# EAGLE design transponder-7.0.0 (EAGLE 9.6.1)
Assembly variants: Supercap, No supercap

## Sheet 1 of 7
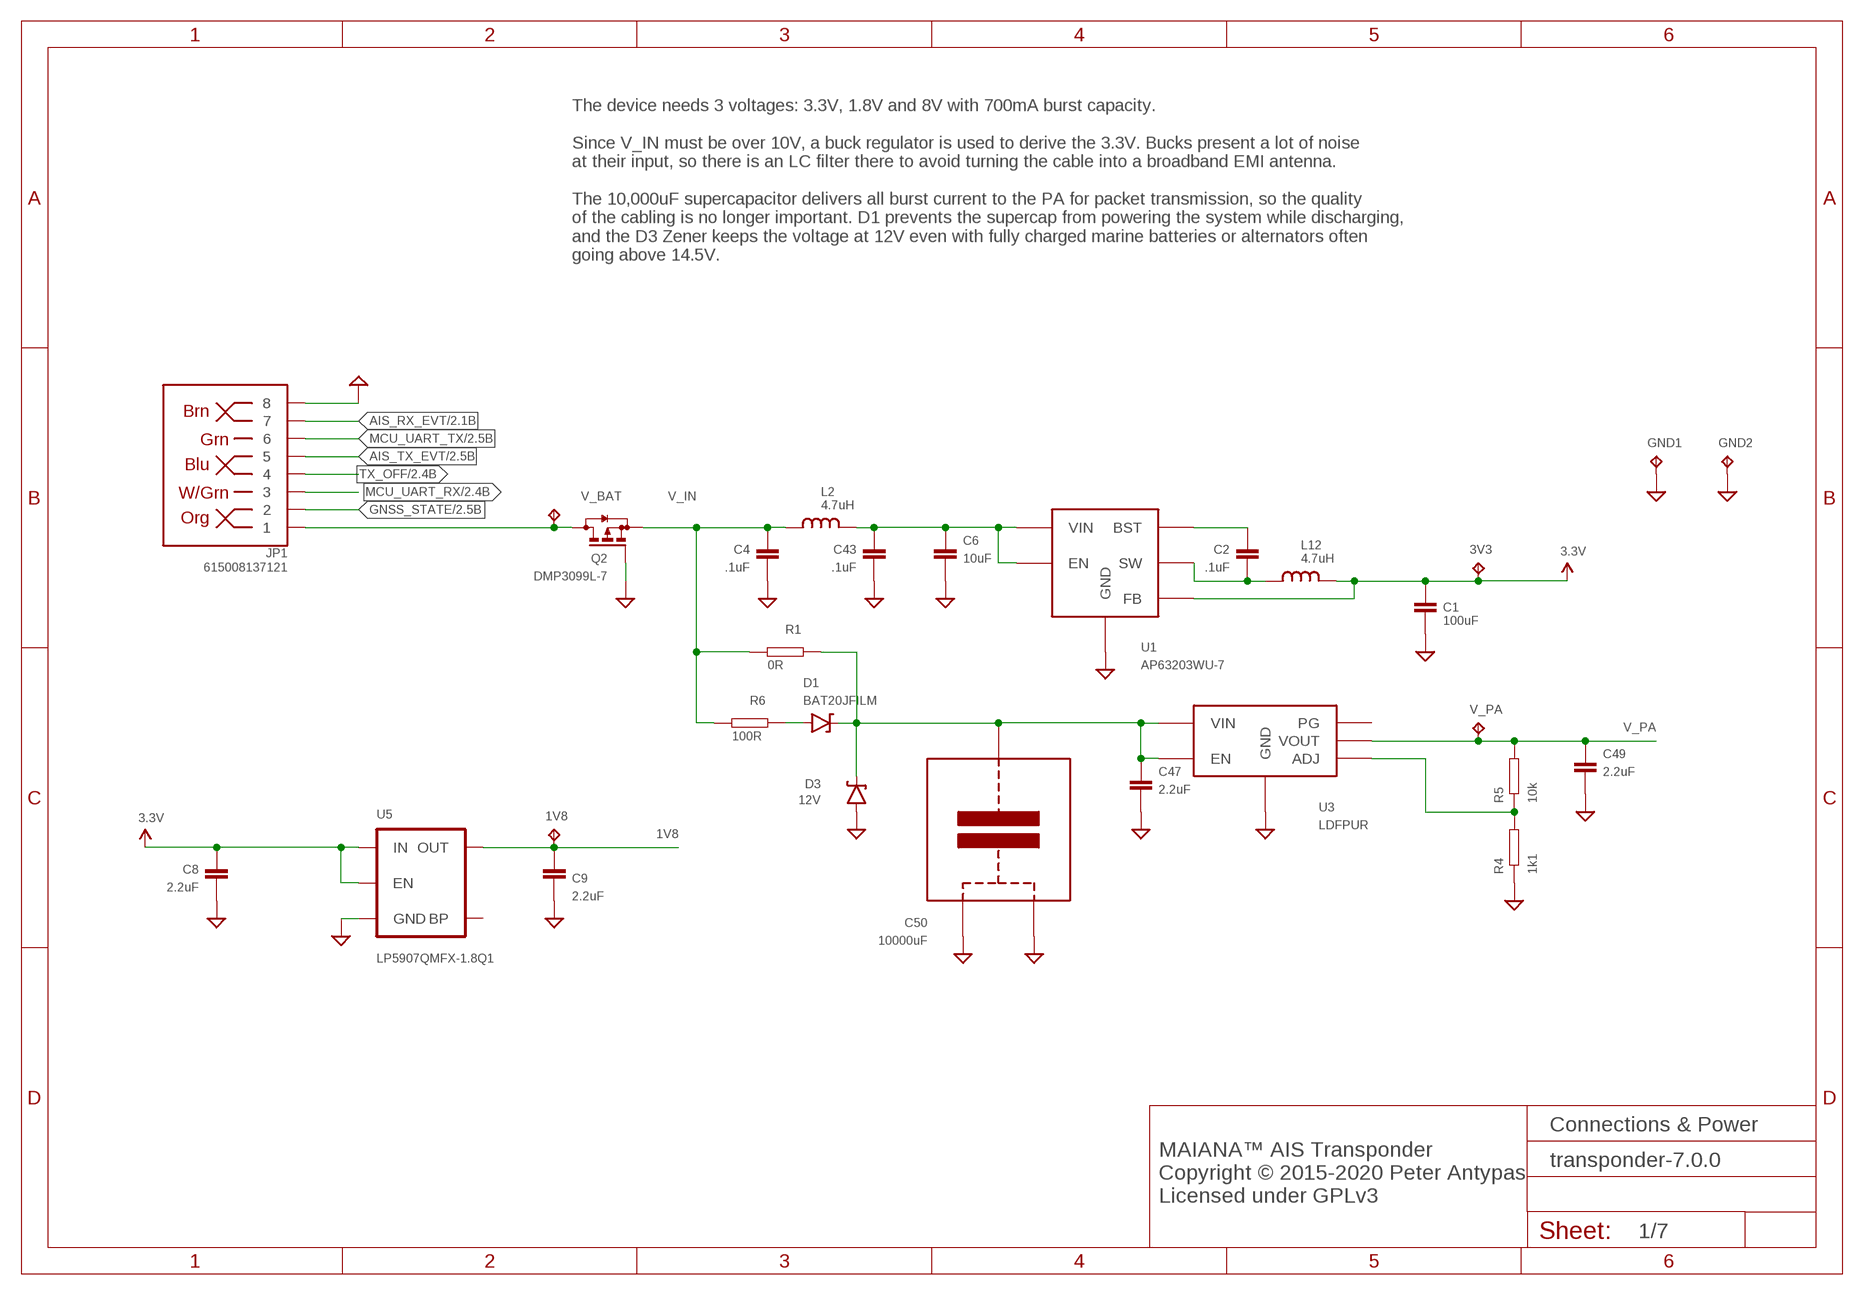
[diagram p0: schematic, sheet 1]

### Parts
1V8  TPTP12R  [TP12R]
3V3  TPTP12R  [TP12R]
C1  100uF  CAPACITOR1206  [1206]
C2  .1uF  CAPACITOR0603  [0603]
C4  .1uF  CAPACITOR0603  [0603]
C6  10uF  CAPACITOR0805  [0805]
C8  2.2uF  CAPACITOR0603  [0603]
C9  2.2uF  CAPACITOR0603  [0603]
C43  .1uF  CAPACITOR0603  [0603]
C47  2.2uF  CAPACITOR0603  [0603]
C49  2.2uF  CAPACITOR0603  [0603]
C50  10000uF  BZ05CA103ZSB  [BZ05]  (not fitted in variant No supercap)
D1  BAT20JFILM  DIODE-SCHOTTKYSOD323  [SOD323]  (not fitted in variant No supercap)
D3  12V  DIODE-ZENER5.6V  [SOD-323]  (not fitted in variant No supercap)
GND1  TPTP16R  [TP16R]
GND2  TPTP16R  [TP16R]
JP1  615008137121  RJ45-8PTH  [RJ45-8]
L2  4.7uH  INDUCTOR0805  [0805]
L12  4.7uH  INDUCTOR0805  [0805]
Q2  DMP3099L-7  BSS84  [SOT23]
R1  0R  RESISTOR0603  [0603]  (not fitted in variant Supercap)
R4  1k1  RESISTOR0603  [0603]
R5  10k  RESISTOR0603  [0603]
R6  100R  RESISTOR0603  [0603]  (not fitted in variant No supercap)
U1  AP63203WU-7  AP63203  [SOT23-6]
U3  LDFPUR  LDF  [DFN-6]
U5  LP5907QMFX-1.8Q1  V_REG_LDOSMD  [SOT23-5]
V_BAT  TPTP12R  [TP12R]
V_PA  TPTP12R  [TP12R]

### Nets
1V8: 1V8.TP C9.P$1 U5.5(OUT) ; also sheet 6,7
3.3V: 3V3.TP C1.P$1 C8.P$1 L12.P$2 U1.1(FB) U5.1(IN) U5.3(EN) ; also sheet 2,3,4,6,7
AIS_RX_EVT: JP1.7 ; also sheet 2
AIS_TX_EVT: JP1.5 ; also sheet 2
BST: C2.P$1 U1.6(BST)
GND: C1.P$2 C4.P$2 C6.P$2 C8.P$2 C9.P$2 C43.P$2 C47.P$2 C49.P$2 C50.P$1 C50.P$2 D3.A GND1.TP GND2.TP JP1.8 Q2.1(G) R4.P$1 U1.4(GND) U3.P$4(GND) U3.P$7(GND) U5.2(GND) ; also sheet 2,3,4,5,6,7
GNSS_STATE: JP1.2 ; also sheet 2
MCU_UART_RX: JP1.3 ; also sheet 2
MCU_UART_TX: JP1.6 ; also sheet 2
N$2: D1.A R6.P$2
N$27: C6.P$1 C43.P$1 L2.P$2 U1.2(EN) U1.3(VIN)
N$32: R4.P$2 R5.P$1 U3.P$2(ADJ)
SW: C2.P$2 L12.P$1 U1.5(SW)
TX_OFF: JP1.4 ; also sheet 2
V_BAT: JP1.1 Q2.3(D) V_BAT.TP
V_IN: C4.P$1 L2.P$1 Q2.2(S) R1.P$1 R6.P$1
V_PA: C49.P$1 R5.P$2 U3.P$1(VOUT) V_PA.TP ; also sheet 5
V_PA_SRC: C47.P$1 C50.P$3 D1.C D3.C R1.P$2 U3.P$5(EN) U3.P$6(VIN)
Unconnected: U3.P$3(PG) U5.4(BP)

### Notes on the sheet
- The device needs 3 voltages: 3.3V, 1.8V and 8V with 700mA burst capacity. 
  
  Since V_IN must be over 10V, a buck regulator is used to derive the 3.3V. Bucks present a lot of noise
  at their input, so there is an LC filter there to avoid turning the cable into a broadband EMI antenna.
  
  The 10,000uF supercapacitor delivers all burst current to the PA for packet transmission, so the quality
  of the cabling is no longer important. D1 prevents the supercap from powering the system while discharging,
  and the D3 Zener keeps the voltage at 12V even with fully charged marine batteries or alternators often 
  going above 14.5V.
- Connections & Power
- MAIANA™ AIS Transponder
  Copyright © 2015-2020 Peter Antypas
  Licensed under GPLv3

## Sheet 2 of 7
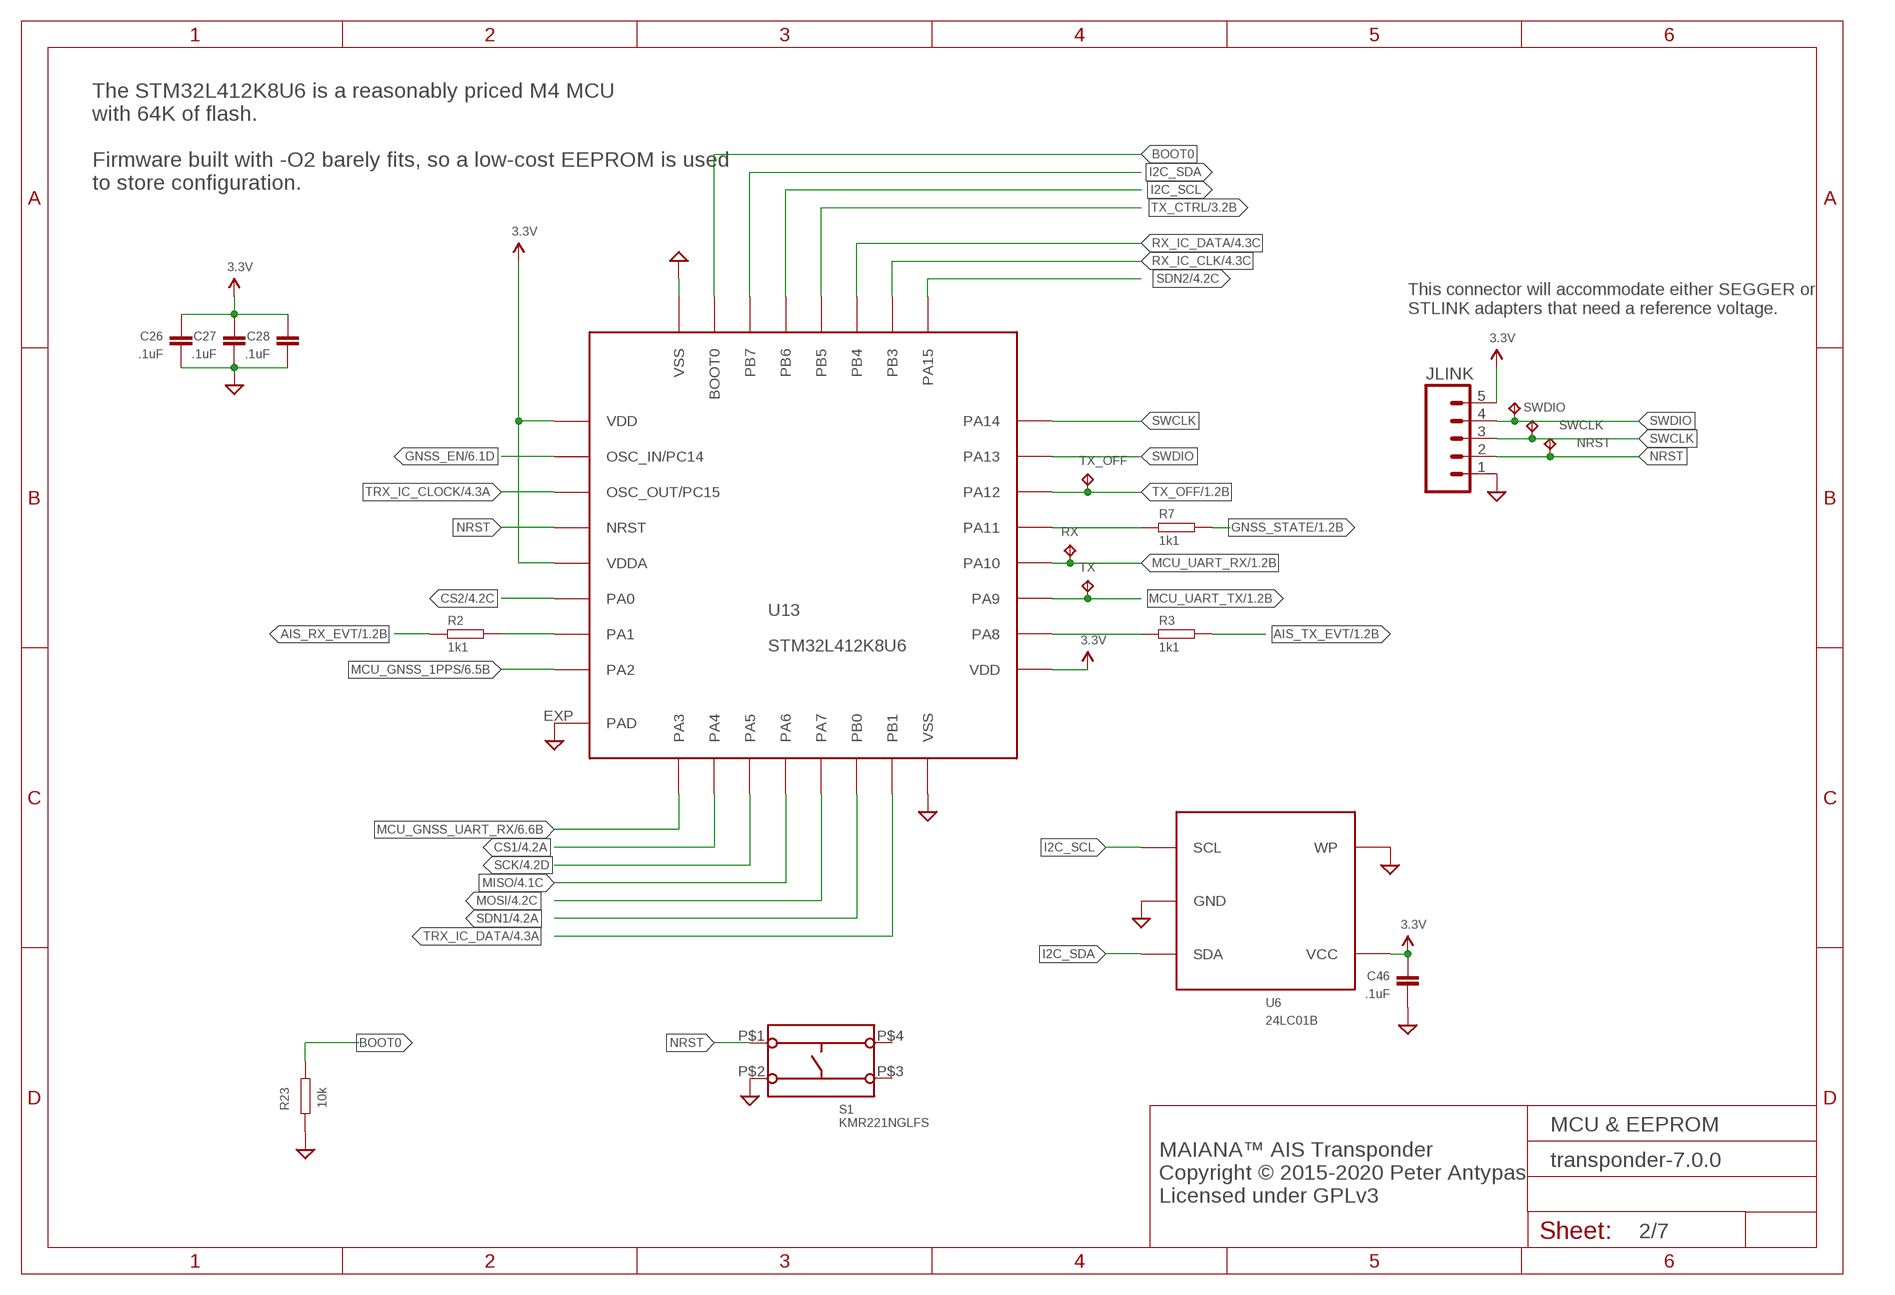
[diagram p1: schematic, sheet 2]

### Parts
C26  .1uF  CAPACITOR0603  [0603]
C27  .1uF  CAPACITOR0603  [0603]
C28  .1uF  CAPACITOR0603  [0603]
C46  .1uF  CAPACITOR0603  [0603]
JLINK  M05PTH  [1X05]
NRST  TPTP12R  [TP12R]
R2  1k1  RESISTOR0603  [0603]
R3  1k1  RESISTOR0603  [0603]
R7  1k1  RESISTOR0603  [0603]
R23  10k  RESISTOR0603  [0603]
RX  TPTP12R  [TP12R]
S1  KMR221NGLFS  [KMR221NGLFS]
SWCLK  TPTP12R  [TP12R]
SWDIO  TPTP12R  [TP12R]
TX  TPTP12R  [TP12R]
TX_OFF  TPTP12R  [TP12R]
U6  24LC01B  [SOT23-5]
U13  STM32L412K8U6  STM32L432KXXX  [QFN32]

### Nets
3.3V: C26.P$1 C27.P$1 C28.P$1 C46.P$1 JLINK.5 U6.4(VCC) U13.1(VDD) U13.5(VDDA) U13.17(VDD) ; also sheet 1,3,4,6,7
AIS_RX_EVT: R2.P$1 ; also sheet 1
AIS_TX_EVT: R3.P$2 ; also sheet 1
BOOT0: R23.P$1 U13.31(BOOT0)
CS1: U13.10(PA4) ; also sheet 4
CS2: U13.6(PA0) ; also sheet 4
GND: C26.P$2 C27.P$2 C28.P$2 C46.P$2 JLINK.1 R23.P$2 S1.P$2(S2) U6.2(GND) U6.5(WP) U13.16(VSS) U13.32(VSS) U13.EXP(PAD) ; also sheet 1,3,4,5,6,7
GNSS_EN: U13.2(OSC_IN/PC14) ; also sheet 6
GNSS_STATE: R7.P$2 ; also sheet 1
I2C_SCL: U6.1(SCL) U13.29(PB6)
I2C_SDA: U6.3(SDA) U13.30(PB7)
MCU_GNSS_1PPS: U13.8(PA2) ; also sheet 6
MCU_GNSS_UART_RX: U13.9(PA3) ; also sheet 6
MCU_UART_RX: RX.TP U13.20(PA10) ; also sheet 1
MCU_UART_TX: TX.TP U13.19(PA9) ; also sheet 1
MISO: U13.12(PA6) ; also sheet 4
MOSI: U13.13(PA7) ; also sheet 4
N$35: R2.P$2 U13.7(PA1)
N$36: R3.P$1 U13.18(PA8)
N$37: R7.P$1 U13.21(PA11)
NRST: JLINK.2 NRST.TP S1.P$1(S1) U13.4(NRST)
RX_IC_CLK: U13.26(PB3) ; also sheet 4
RX_IC_DATA: U13.27(PB4) ; also sheet 4
SCK: U13.11(PA5) ; also sheet 4
SDN1: U13.14(PB0) ; also sheet 4
SDN2: U13.25(PA15) ; also sheet 4
SWCLK: JLINK.3 SWCLK.TP U13.24(PA14)
SWDIO: JLINK.4 SWDIO.TP U13.23(PA13)
TRX_IC_CLOCK: U13.3(OSC_OUT/PC15) ; also sheet 4
TRX_IC_DATA: U13.15(PB1) ; also sheet 4
TX_CTRL: U13.28(PB5) ; also sheet 3,5,7
TX_OFF: TX_OFF.TP U13.22(PA12) ; also sheet 1
Unconnected: S1.P$3(S2) S1.P$4(S1)

### Notes on the sheet
- The STM32L412K8U6 is a reasonably priced M4 MCU
  with 64K of flash. 
  
  Firmware built with -O2 barely fits, so a low-cost EEPROM is used
  to store configuration.
- This connector will accommodate either SEGGER or
  STLINK adapters that need a reference voltage.
- MCU & EEPROM
- MAIANA™ AIS Transponder
  Copyright © 2015-2020 Peter Antypas
  Licensed under GPLv3

## Sheet 3 of 7
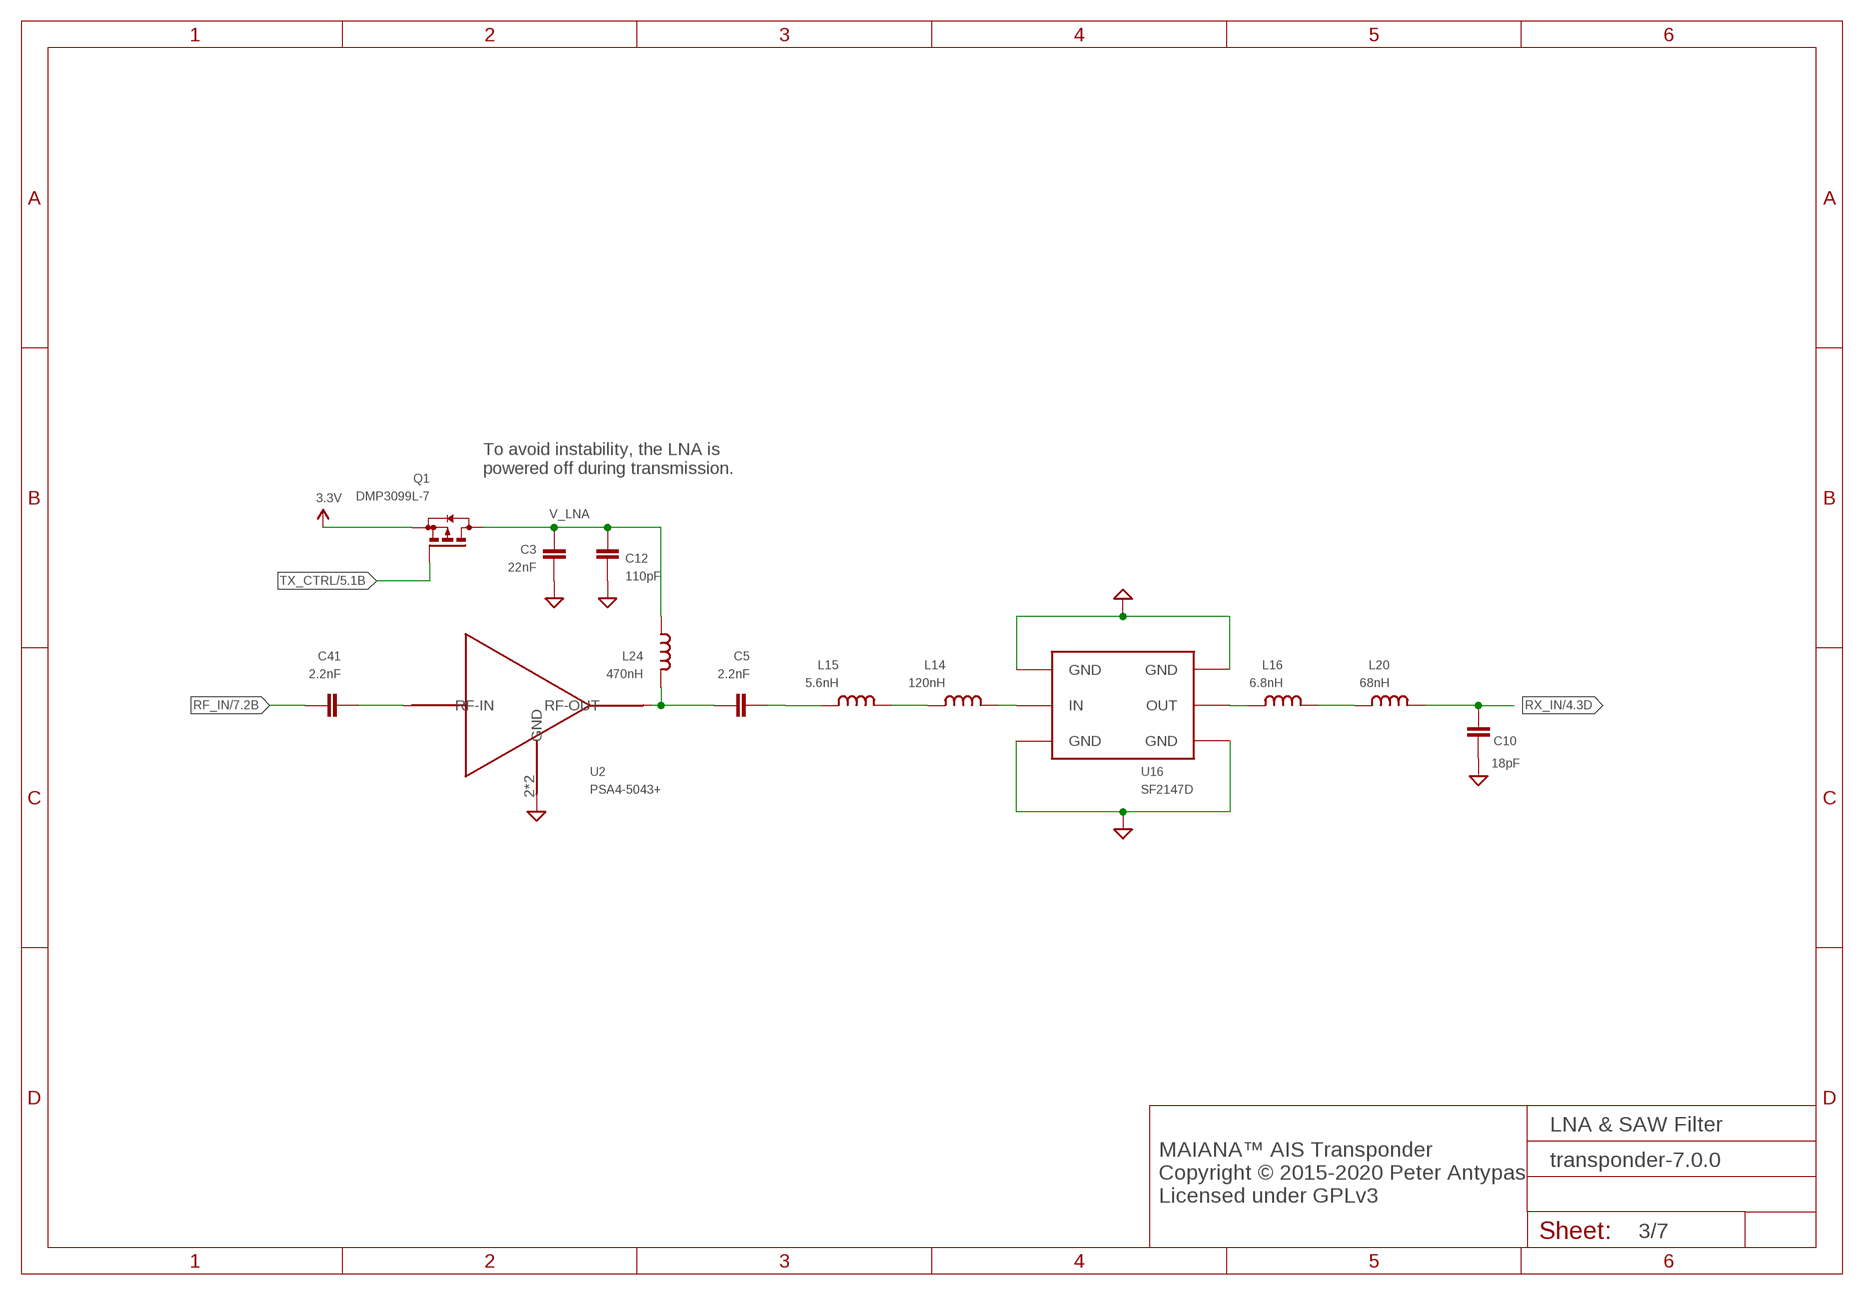
[diagram p2: schematic, sheet 3]

### Parts
C3  22nF  CAPACITOR0603  [0603]
C5  2.2nF  CAPACITOR0603  [0603]
C10  18pF  CAPACITOR0603  [0603]
C12  110pF  CAPACITOR0603  [0603]
C41  2.2nF  CAPACITOR0603  [0603]
L14  120nH  INDUCTOR0603  [0603]
L15  5.6nH  INDUCTOR0603  [0603]
L16  6.8nH  INDUCTOR0603  [0603]
L20  68nH  INDUCTOR0603  [0603]
L24  470nH  INDUCTOR0603  [0603]
Q1  DMP3099L-7  BSS84  [SOT23]
U2  PSA4-5043+  [PSA4-5043+]
U16  SF2147D  [SAW_FILTER1]

### Nets
3.3V: Q1.2(S) ; also sheet 1,2,4,6,7
GND: C3.P$2 C10.P$1 C12.P$1 U2.2(GND) U2.4(GND) U16.P$1(GND) U16.P$3(GND) U16.P$4(GND) U16.P$6(GND) ; also sheet 1,2,4,5,6,7
N$4: L14.P$1 U16.P$2(IN)
N$5: C41.P$2 U2.3(RF-IN)
N$9: L14.P$2 L15.P$1
N$22: C5.P$1 L24.P$2 U2.1(RF-OUT)
N$25: C5.P$2 L15.P$2
N$33: L16.P$2 U16.P$5(OUT)
N$34: L16.P$1 L20.P$2
RF_IN: C41.P$1 ; also sheet 7
RX_IN: C10.P$2 L20.P$1 ; also sheet 4
TX_CTRL: Q1.1(G) ; also sheet 2,5,7
V_LNA: C3.P$1 C12.P$2 L24.P$1 Q1.3(D)

### Notes on the sheet
- To avoid instability, the LNA is 
  powered off during transmission.
- LNA & SAW Filter
- MAIANA™ AIS Transponder
  Copyright © 2015-2020 Peter Antypas
  Licensed under GPLv3

## Sheet 4 of 7
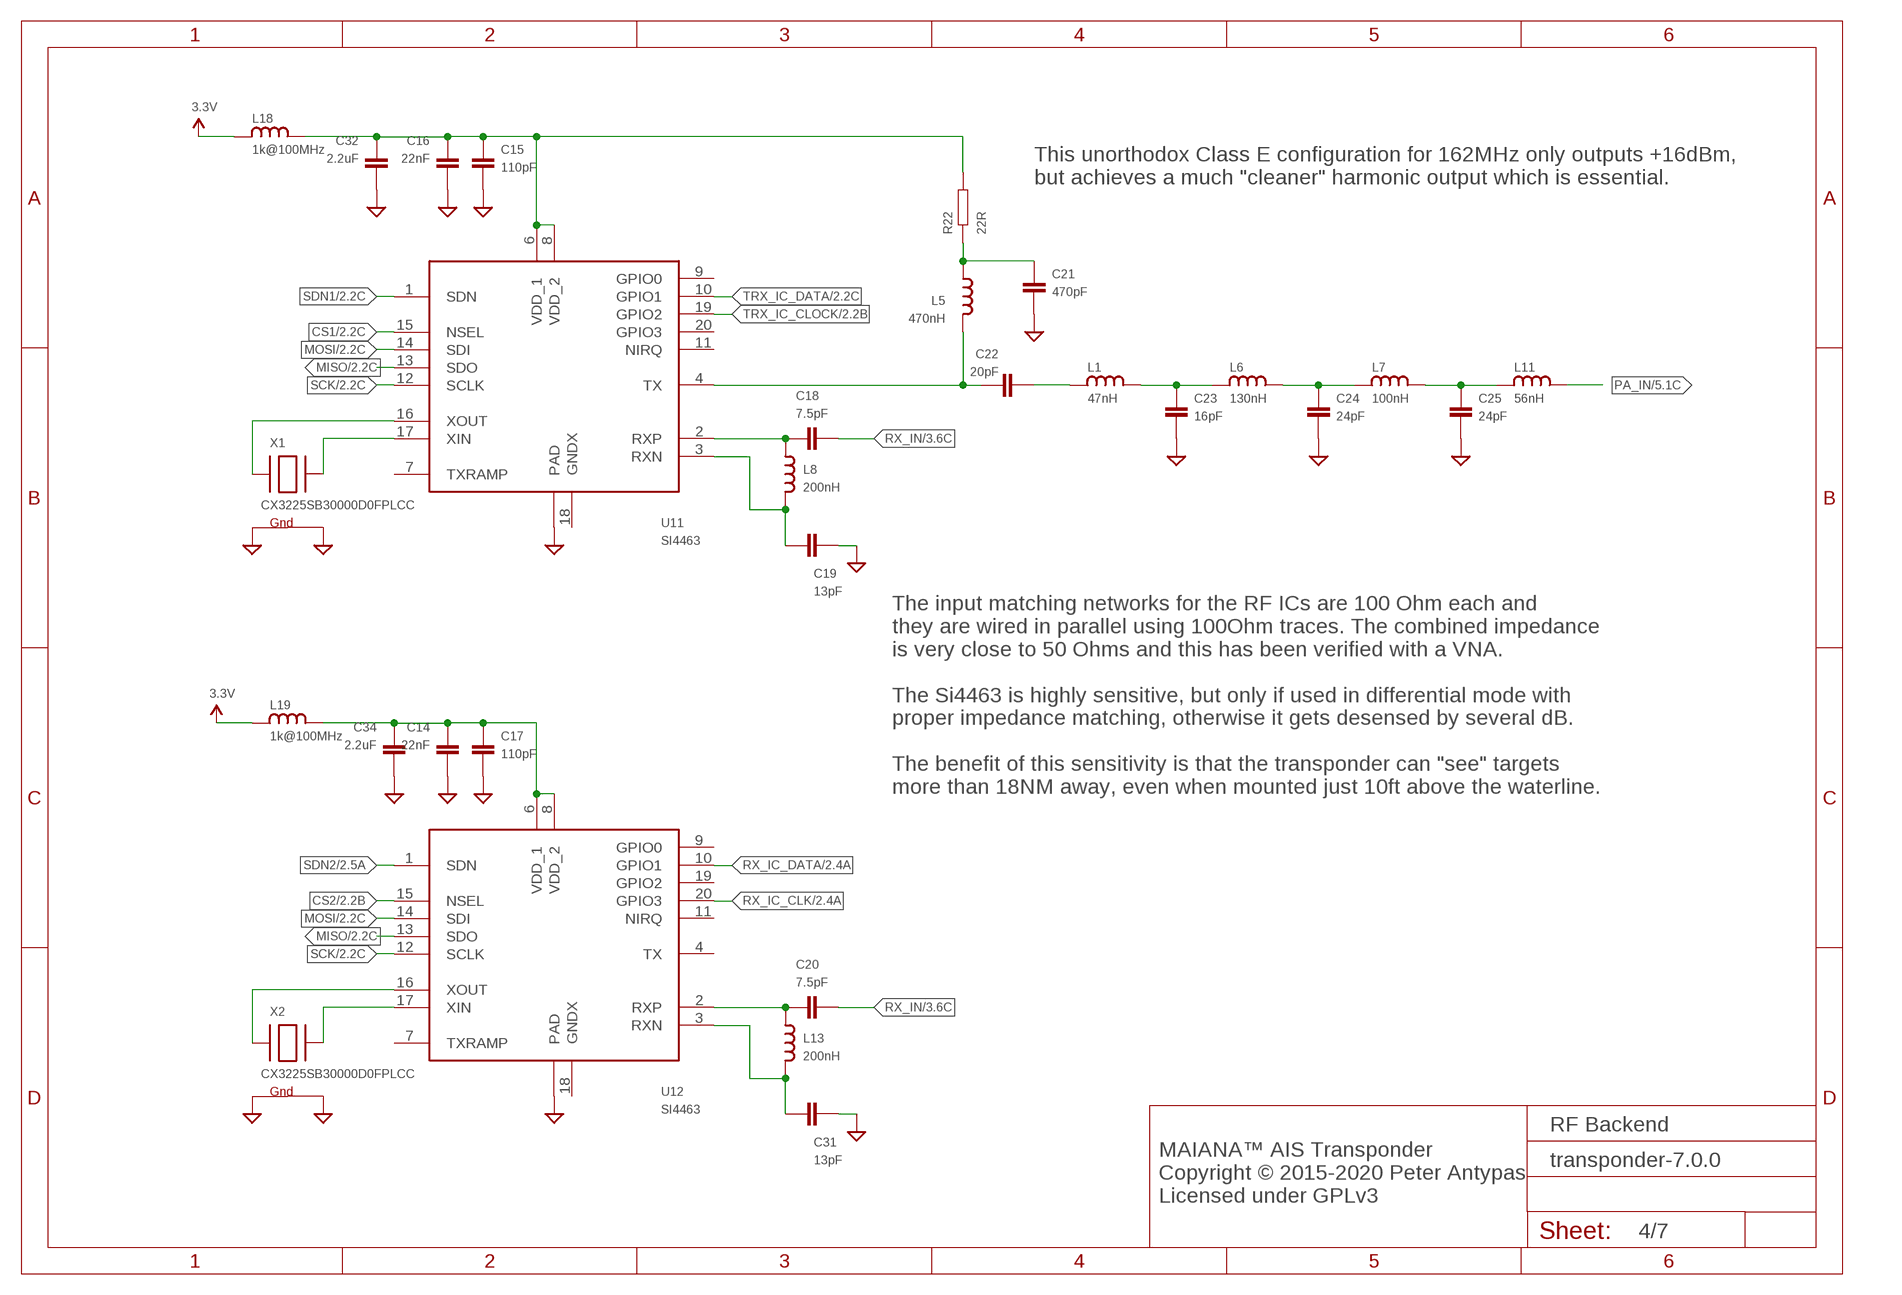
[diagram p3: schematic, sheet 4]

### Parts
C14  22nF  CAPACITOR0603  [0603]
C15  110pF  CAPACITOR0603  [0603]
C16  22nF  CAPACITOR0603  [0603]
C17  110pF  CAPACITOR0603  [0603]
C18  7.5pF  CAPACITOR0603  [0603]
C19  13pF  CAPACITOR0603  [0603]
C20  7.5pF  CAPACITOR0603  [0603]
C21  470pF  CAPACITOR0603  [0603]
C22  20pF  CAPACITOR0603  [0603]
C23  16pF  CAPACITOR0603  [0603]
C24  24pF  CAPACITOR0603  [0603]
C25  24pF  CAPACITOR0603  [0603]
C31  13pF  CAPACITOR0603  [0603]
C32  2.2uF  CAPACITOR0603  [0603]
C34  2.2uF  CAPACITOR0603  [0603]
L1  47nH  INDUCTOR0603  [0603]
L5  470nH  INDUCTOR0603  [0603]
L6  130nH  INDUCTOR0603  [0603]
L7  100nH  INDUCTOR0603  [0603]
L8  200nH  INDUCTOR0603  [0603]
L11  56nH  INDUCTOR0603  [0603]
L13  200nH  INDUCTOR0603  [0603]
L18  1k@100MHz  INDUCTOR0603  [0603]
L19  1k@100MHz  INDUCTOR0603  [0603]
R22  22R  RESISTOR0603  [0603]
U11  SI4463  [SI4463]
U12  SI4463  [SI4463]
X1  CX3225SB30000D0FPLCC  XTAL-4-3225  [NX3225]
X2  CX3225SB30000D0FPLCC  XTAL-4-3225  [NX3225]

### Nets
3.3V: L18.P$1 L19.P$1 ; also sheet 1,2,3,6,7
CS1: U11.15(NSEL) ; also sheet 2
CS2: U12.15(NSEL) ; also sheet 2
GND: C14.P$2 C15.P$2 C16.P$2 C17.P$2 C19.P$1 C21.P$2 C23.P$2 C24.P$2 C25.P$2 C31.P$1 C32.P$2 C34.P$2 U11.EXP(PAD) U12.EXP(PAD) X1.2(G2) X1.4(G1) X2.2(G2) X2.4(G1) ; also sheet 1,2,3,5,6,7
MISO: U11.13(SDO) U12.13(SDO) ; also sheet 2
MOSI: U11.14(SDI) U12.14(SDI) ; also sheet 2
N$1: C15.P$1 C16.P$1 C32.P$1 L18.P$2 R22.P$2 U11.6(VDD_1) U11.8(VDD_2)
N$3: C19.P$2 L8.P$2 U11.3(RXN)
N$6: C18.P$1 L8.P$1 U11.2(RXP)
N$7: C24.P$1 L6.P$2 L7.P$1
N$11: C25.P$1 L7.P$2 L11.P$1
N$12: C23.P$1 L1.P$2 L6.P$1
N$14: C14.P$1 C17.P$1 C34.P$1 L19.P$2 U12.6(VDD_1) U12.8(VDD_2)
N$16: U12.16(XOUT) X2.1(X1)
N$17: U12.17(XIN) X2.3(X2)
N$18: U11.16(XOUT) X1.1(X1)
N$19: U11.17(XIN) X1.3(X2)
N$20: C20.P$1 L13.P$1 U12.2(RXP)
N$21: C31.P$2 L13.P$2 U12.3(RXN)
N$24: C22.P$1 L5.P$2 U11.4(TX)
N$30: C21.P$1 L5.P$1 R22.P$1
N$31: C22.P$2 L1.P$1
PA_IN: L11.P$2 ; also sheet 5
RX_IC_CLK: U12.20(GPIO3) ; also sheet 2
RX_IC_DATA: U12.10(GPIO1) ; also sheet 2
RX_IN: C18.P$2 C20.P$2 ; also sheet 3
SCK: U11.12(SCLK) U12.12(SCLK) ; also sheet 2
SDN1: U11.1(SDN) ; also sheet 2
SDN2: U12.1(SDN) ; also sheet 2
TRX_IC_CLOCK: U11.19(GPIO2) ; also sheet 2
TRX_IC_DATA: U11.10(GPIO1) ; also sheet 2
Unconnected: U11.7(TXRAMP) U11.9(GPIO0) U11.11(NIRQ) U11.18(GNDX) U11.20(GPIO3) U12.4(TX) U12.7(TXRAMP) U12.9(GPIO0) U12.11(NIRQ) U12.18(GNDX) U12.19(GPIO2)

### Notes on the sheet
- This unorthodox Class E configuration for 162MHz only outputs +16dBm,  
  but achieves a much "cleaner" harmonic output which is essential.
- The input matching networks for the RF ICs are 100 Ohm each and 
  they are wired in parallel using 100Ohm traces. The combined impedance
  is very close to 50 Ohms and this has been verified with a VNA.
  
  The Si4463 is highly sensitive, but only if used in differential mode with
  proper impedance matching, otherwise it gets desensed by several dB.
  
  The benefit of this sensitivity is that the transponder can "see" targets
  more than 18NM away, even when mounted just 10ft above the waterline.
- RF Backend
- MAIANA™ AIS Transponder
  Copyright © 2015-2020 Peter Antypas
  Licensed under GPLv3

## Sheet 5 of 7
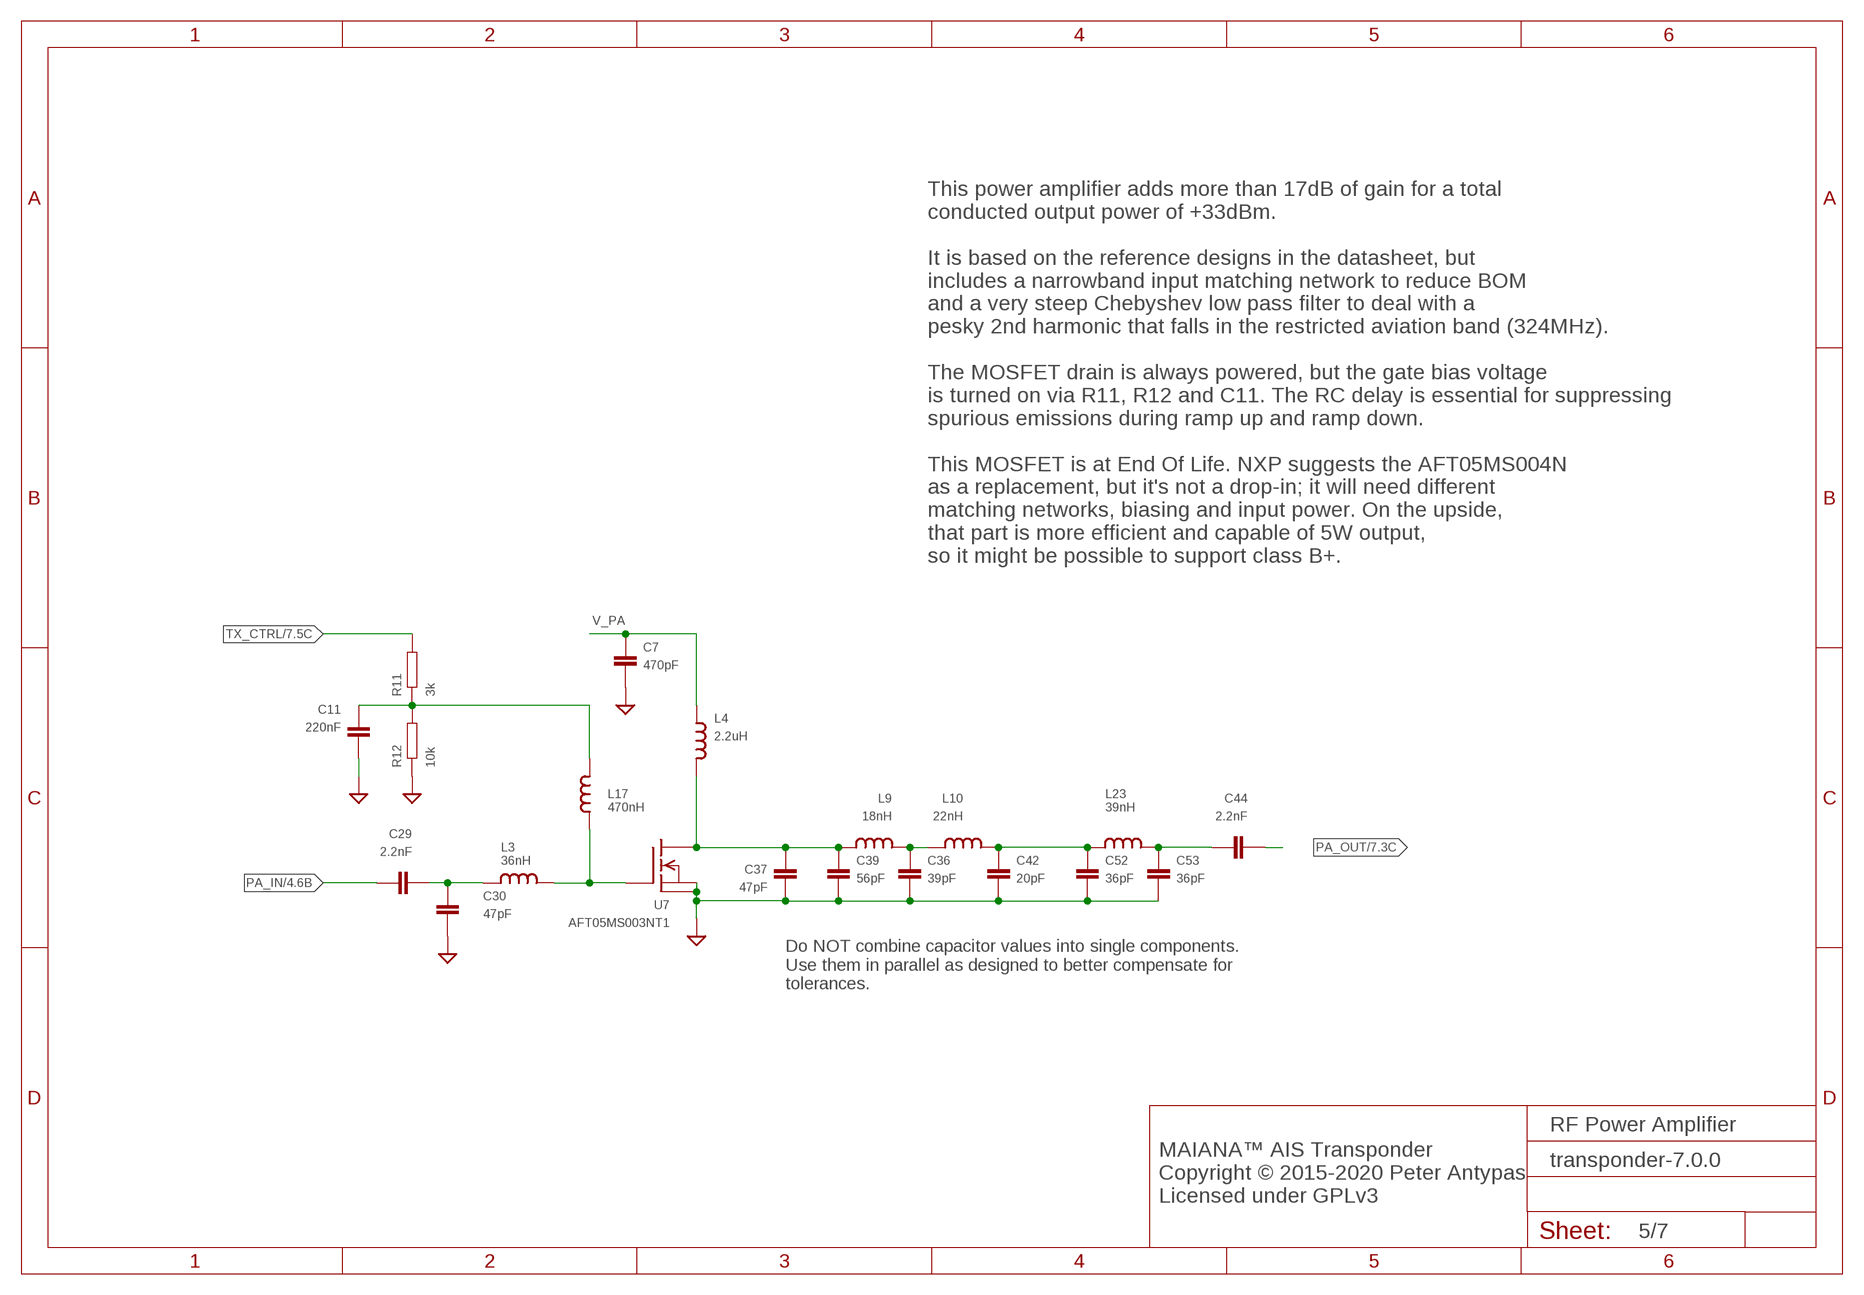
[diagram p4: schematic, sheet 5]

### Parts
C7  470pF  CAPACITOR0603  [0603]
C11  220nF  CAPACITOR0603  [0603]
C29  2.2nF  CAPACITOR0603  [0603]
C30  47pF  CAPACITOR0603  [0603]
C36  39pF  CAPACITOR0603  [0603]
C37  47pF  CAPACITOR0603  [0603]
C39  56pF  CAPACITOR0603  [0603]
C42  20pF  CAPACITOR0603  [0603]
C44  2.2nF  CAPACITOR0603  [0603]
C52  36pF  CAPACITOR0603  [0603]
C53  36pF  CAPACITOR0603  [0603]
L3  36nH  INDUCTOR0603  [0603]
L4  2.2uH  INDUCTOR0805  [0805]
L9  18nH  INDUCTOR0603  [0603]
L10  22nH  INDUCTOR0603  [0603]
L17  470nH  INDUCTOR0603  [0603]
L23  39nH  INDUCTOR0603  [0603]
R11  3k  RESISTOR0603  [0603]
R12  10k  RESISTOR0603  [0603]
U7  AFT05MS003NT1  AFT0SMS003N  [SOT-89]

### Nets
GND: C7.P$2 C11.P$2 C30.P$2 C36.P$2 C37.P$2 C39.P$2 C42.P$2 C52.P$2 C53.P$2 R12.P$1 U7.2(S) U7.2@1(PAD) ; also sheet 1,2,3,4,6,7
N$8: C11.P$1 L17.P$2 R11.P$1 R12.P$2
N$23: C37.P$1 C39.P$1 L4.P$2 L9.P$1 U7.3(D)
N$26: L3.P$2 L17.P$1 U7.1(G)
N$28: C36.P$1 L9.P$2 L10.P$1
N$29: C29.P$2 C30.P$1 L3.P$1
N$40: C42.P$1 C52.P$1 L10.P$2 L23.P$1
N$41: C44.P$1 C53.P$1 L23.P$2
PA_IN: C29.P$1 ; also sheet 4
PA_OUT: C44.P$2 ; also sheet 7
TX_CTRL: R11.P$2 ; also sheet 2,3,7
V_PA: C7.P$1 L4.P$1 ; also sheet 1

### Notes on the sheet
- This power amplifier adds more than 17dB of gain for a total
  conducted output power of +33dBm. 
  
  It is based on the reference designs in the datasheet, but
  includes a narrowband input matching network to reduce BOM
  and a very steep Chebyshev low pass filter to deal with a
  pesky 2nd harmonic that falls in the restricted aviation band (324MHz).
  
  The MOSFET drain is always powered, but the gate bias voltage
  is turned on via R11, R12 and C11. The RC delay is essential for suppressing
  spurious emissions during ramp up and ramp down.
  
  This MOSFET is at End Of Life. NXP suggests the AFT05MS004N 
  as a replacement, but it's not a drop-in; it will need different
  matching networks, biasing and input power. On the upside, 
  that part is more efficient and capable of 5W output,
  so it might be possible to support class B+.
- Do NOT combine capacitor values into single components. 
  Use them in parallel as designed to better compensate for
  tolerances.
- RF Power Amplifier
- MAIANA™ AIS Transponder
  Copyright © 2015-2020 Peter Antypas
  Licensed under GPLv3

## Sheet 6 of 7
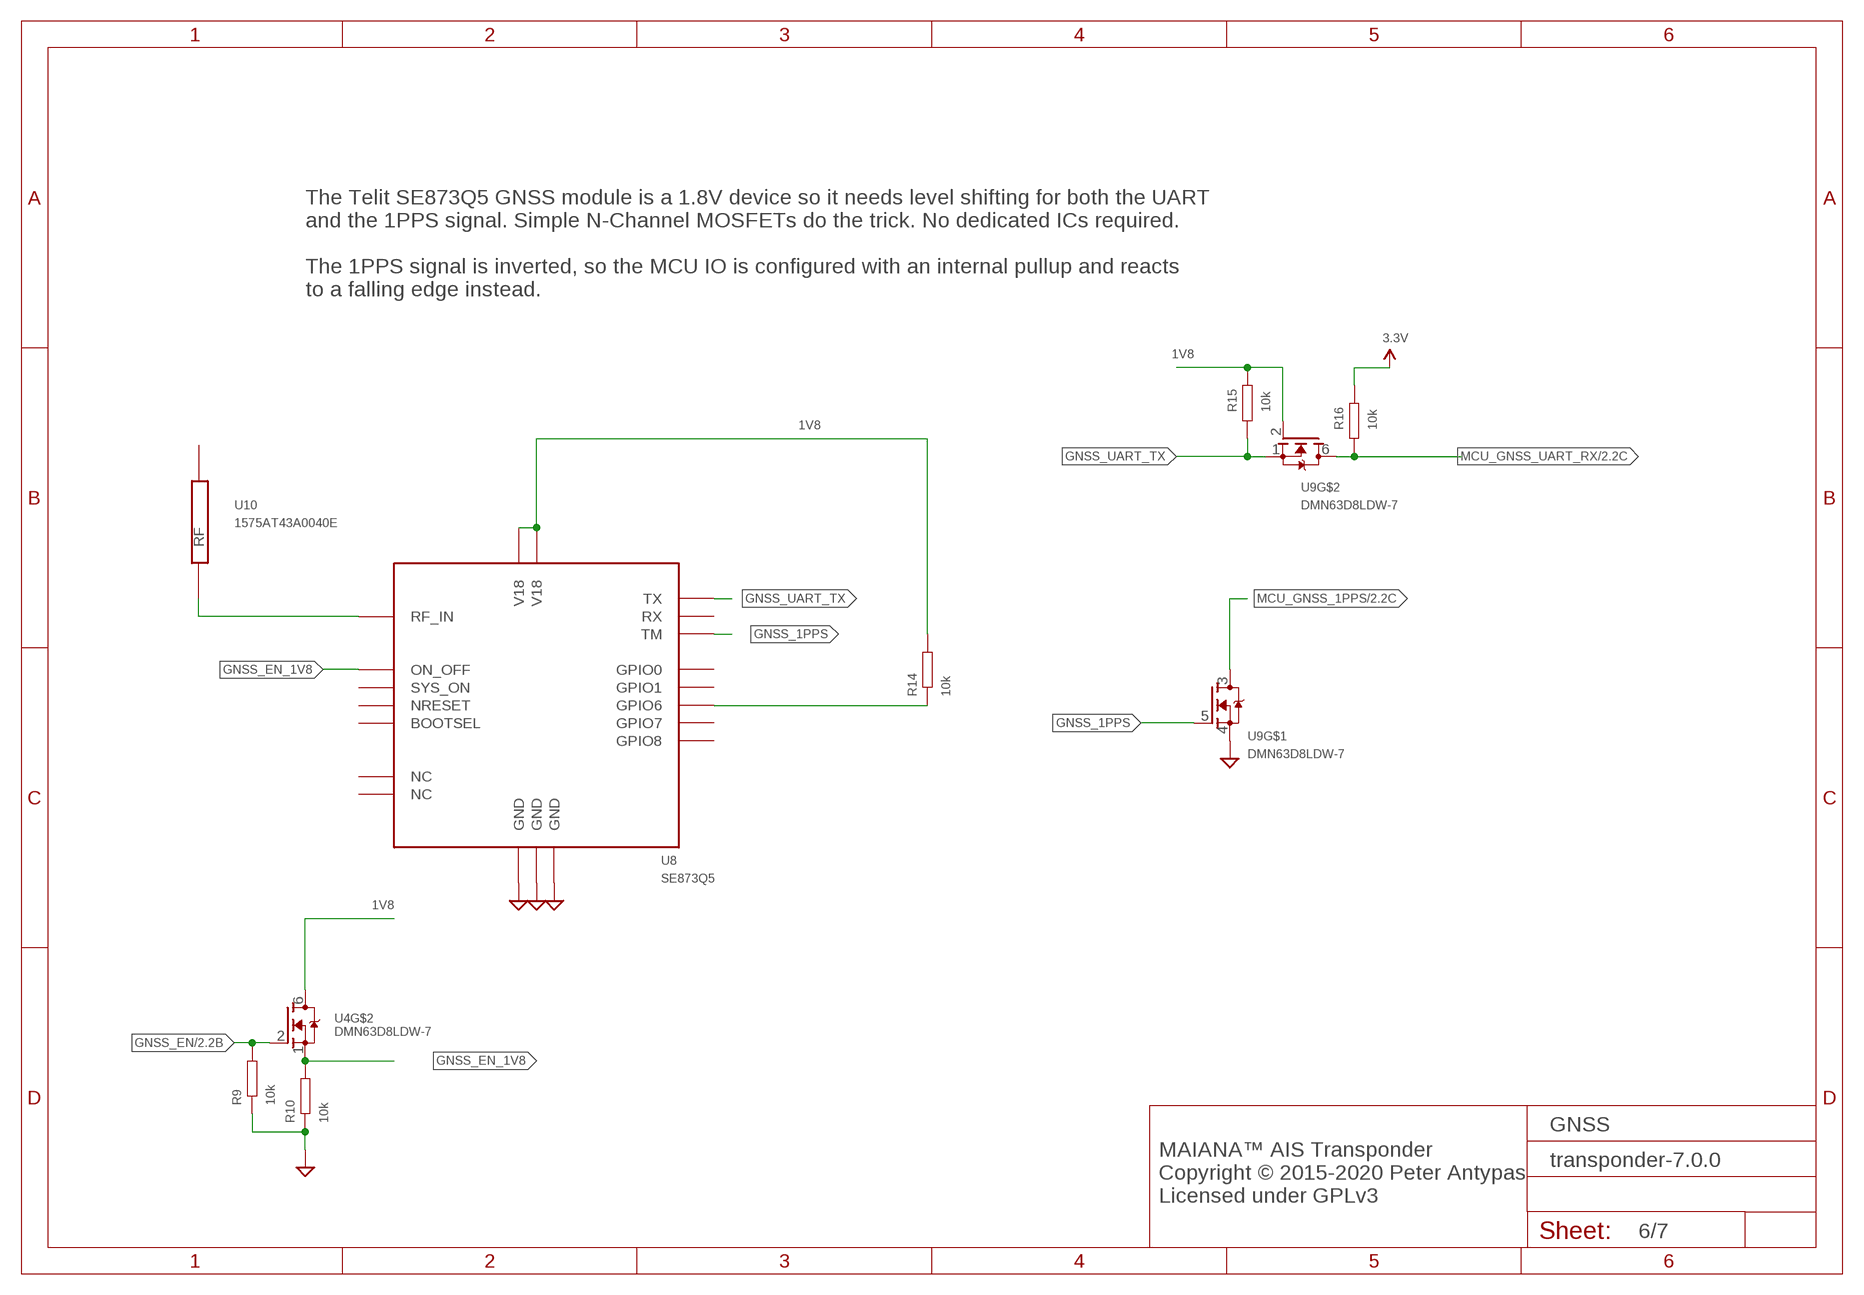
[diagram p5: schematic, sheet 6]

### Parts
R9  10k  RESISTOR0603  [0603]
R10  10k  RESISTOR0603  [0603]
R14  10k  RESISTOR0603  [0603]
R15  10k  RESISTOR0603  [0603]
R16  10k  RESISTOR0603  [0603]
U4  DMN63D8LDW-7  DMN63D8LDW  [SOT363]
U8  SE873Q5  SE873  [SE873]
U9  DMN63D8LDW-7  DMN63D8LDW  [SOT363]
U10  1575AT43A0040E  [1575AT43A0040E]

### Nets
1V8: R14.P$2 R15.P$2 U4.6(D) U8.P$3(V18) U8.P$19(V18) U9.2(G) ; also sheet 1,7
3.3V: R16.P$2 ; also sheet 1,2,3,4,7
GND: R9.P$1 R10.P$1 U8.P$2(GND) U8.P$10(GND) U8.P$20(GND) U9.4(S) ; also sheet 1,2,3,4,5,7
GNSS_1PPS: U8.P$11(TM) U9.5(G)
GNSS_EN: R9.P$2 U4.2(G) ; also sheet 2
GNSS_EN_1V8: R10.P$2 U4.1(S) U8.P$6(ON_OFF)
GNSS_UART_TX: R15.P$1 U8.P$15(TX) U9.1(S)
MCU_GNSS_1PPS: U9.3(D) ; also sheet 2
MCU_GNSS_UART_RX: R16.P$1 U9.6(D) ; also sheet 2
N$10: U8.P$1(RF_IN) U10.P$1(RF)
N$13: R14.P$1 U8.P$13(GPIO6)
Unconnected: U8.P$4(NC) U8.P$5(GPIO8) U8.P$7(SYS_ON) U8.P$8(NRESET) U8.P$9(BOOTSEL) U8.P$12(GPIO7) U8.P$14(RX) U8.P$16(NC) U8.P$17(GPIO1) U8.P$18(GPIO0) U10.P$2(PAD)

### Notes on the sheet
- The Telit SE873Q5 GNSS module is a 1.8V device so it needs level shifting for both the UART
  and the 1PPS signal. Simple N-Channel MOSFETs do the trick. No dedicated ICs required.
  
  The 1PPS signal is inverted, so the MCU IO is configured with an internal pullup and reacts 
  to a falling edge instead.
- GNSS
- MAIANA™ AIS Transponder
  Copyright © 2015-2020 Peter Antypas
  Licensed under GPLv3

## Sheet 7 of 7
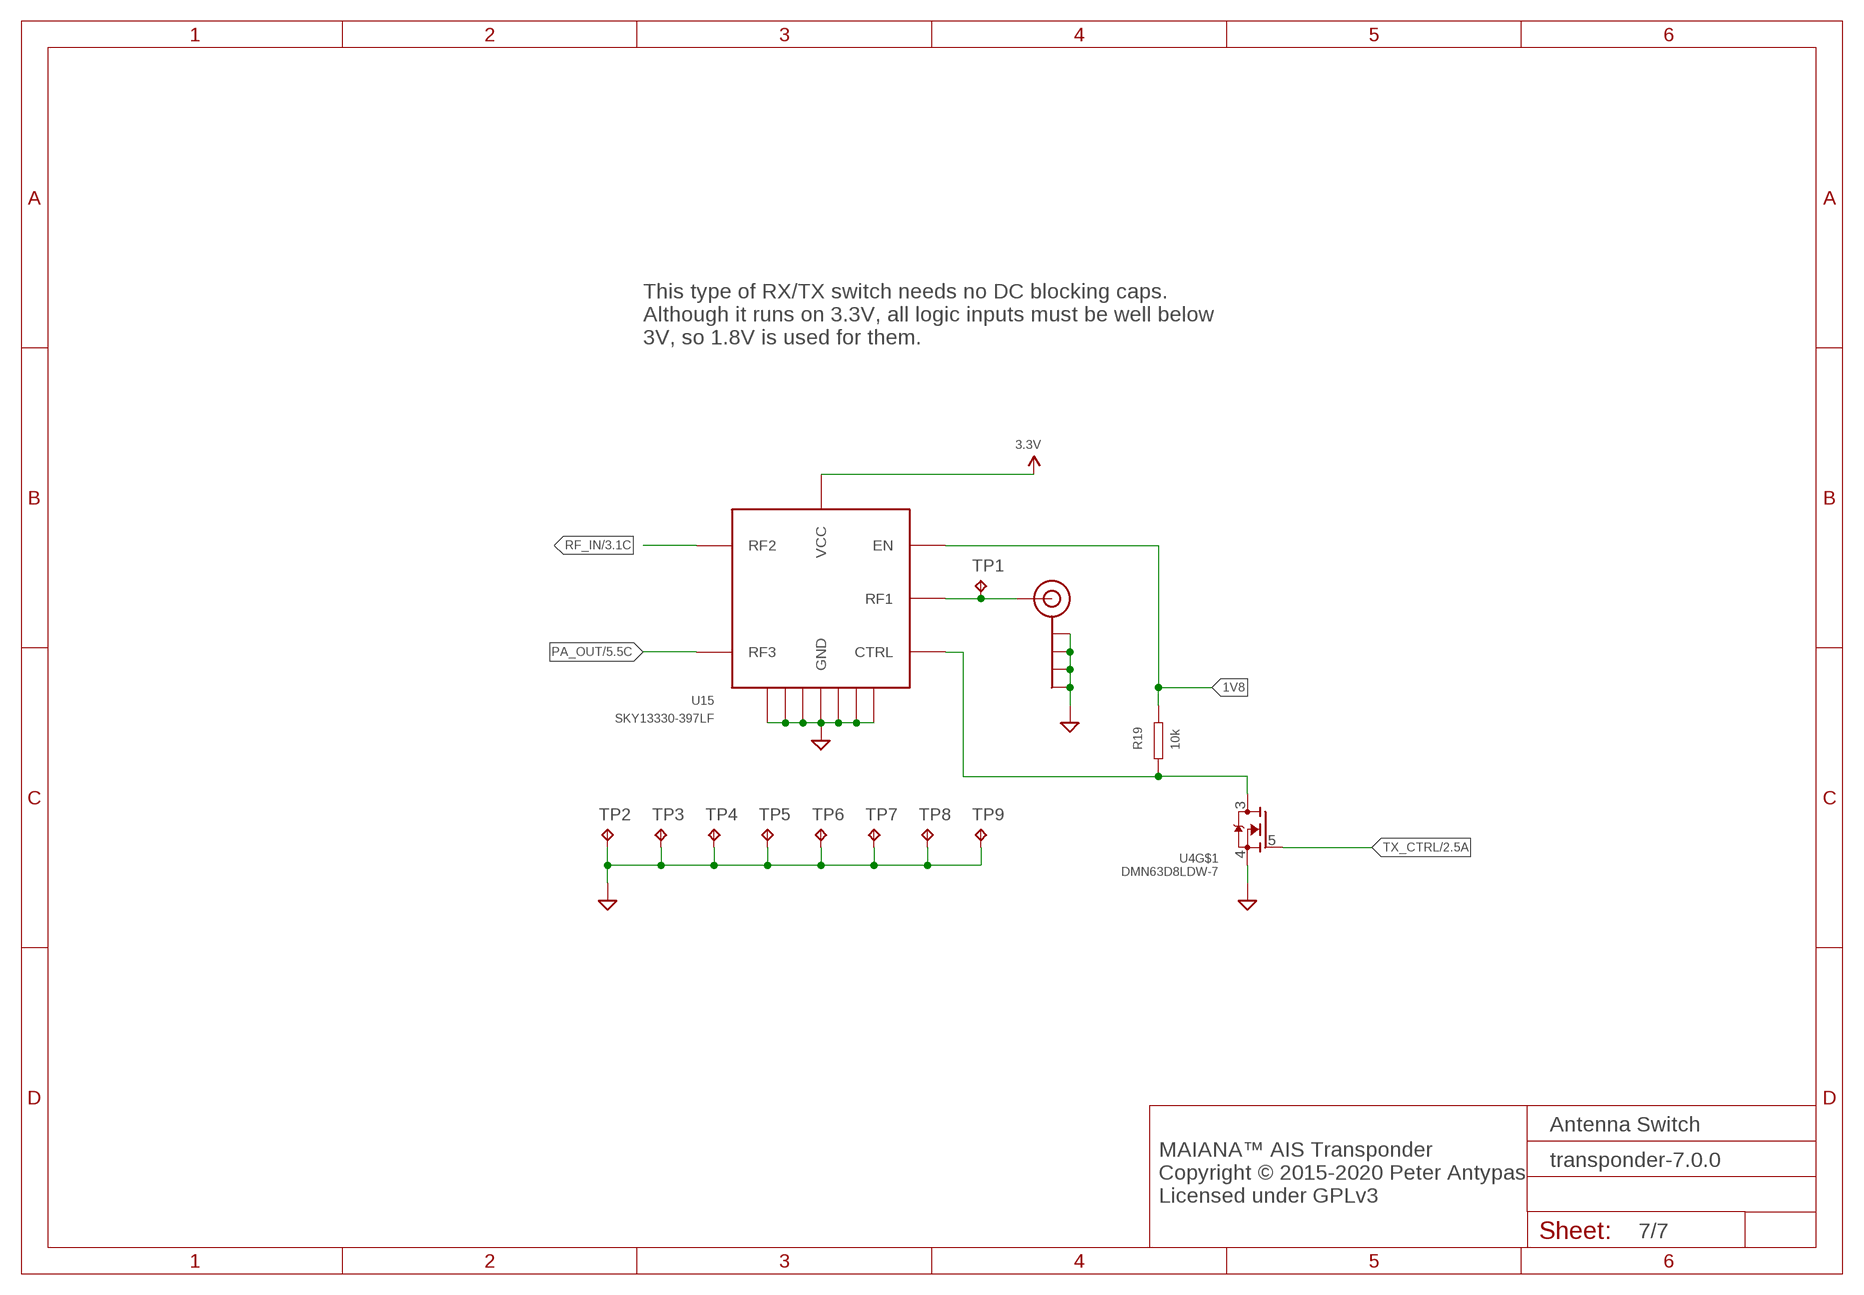
[diagram p6: schematic, sheet 7]

### Parts
J$1  SMA_EDGE  [SMA-EDGE]
R19  10k  RESISTOR0603  [0603]
TP1  TPTP10R  [TP10R]
TP2  TPTP08R  [TP08R]
TP3  TPTP08R  [TP08R]
TP4  TPTP08R  [TP08R]
TP5  TPTP08R  [TP08R]
TP6  TPTP08R  [TP08R]
TP7  TPTP08R  [TP08R]
TP8  TPTP08R  [TP08R]
TP9  TPTP08R  [TP08R]
U15  SKY13330-397LF  SKYWORKS-13330397LF  [QFN12]

### Nets
1V8: R19.P$2 U15.P$8(EN) ; also sheet 1,6
3.3V: U15.P$9(VCC) ; also sheet 1,2,3,4,6
GND: J$1.GND@0(GND) J$1.GND@1(GND) J$1.GND@2(GND) J$1.GND@3(GND) TP2.TP TP3.TP TP4.TP TP5.TP TP6.TP TP7.TP TP8.TP TP9.TP U4.4(S) U15.P$1(GND) U15.P$3(GND) U15.P$4(GND) U15.P$6(GND) U15.P$10(GND) U15.P$12(GND) U15.P$13(GND) ; also sheet 1,2,3,4,5,6
N$15: J$1.SIG(SIGNAL) TP1.TP U15.P$2(RF1)
PA_OUT: U15.P$5(RF3) ; also sheet 5
RF_IN: U15.P$11(RF2) ; also sheet 3
RX_EN: R19.P$1 U4.3(D) U15.P$7(CTRL)
TX_CTRL: U4.5(G) ; also sheet 2,3,5

### Notes on the sheet
- This type of RX/TX switch needs no DC blocking caps. 
  Although it runs on 3.3V, all logic inputs must be well below
  3V, so 1.8V is used for them.
- Antenna Switch
- MAIANA™ AIS Transponder
  Copyright © 2015-2020 Peter Antypas
  Licensed under GPLv3

## Library data of the parts
1V8 3V3 GND1 GND2 NRST RX SWCLK SWDIO TP1-TP9 TX TX_OFF V_BAT V_PA = testpad:TP: Test pad; DNP: T
C1 = MyPassives:CAPACITOR: Standard SMD capacitor; PARTNO: JMK316ABJ107ML-T
C2 C4 C26-C28 C43 C46 = MyPassives:CAPACITOR: Standard SMD capacitor; PARTNO: EMK107B7104KAHT
C3 C14 C16 = MyPassives:CAPACITOR: Standard SMD capacitor; PARTNO: GRM188R71E223KA01D
C5 C29 C41 C44 = MyPassives:CAPACITOR: Standard SMD capacitor; PARTNO: GRM1885C1H222JA01J
C6 = MyPassives:CAPACITOR: Standard SMD capacitor; PARTNO: EMK212ABJ106KG-T
C7 C21 = MyPassives:CAPACITOR: Standard SMD capacitor; PARTNO: GRM1885C1H471JA01D
C8 C9 C32 C34 C47 C49 = MyPassives:CAPACITOR: Standard SMD capacitor; PARTNO: EMK107BJ225KA-T
C10 = MyPassives:CAPACITOR: Standard SMD capacitor; PARTNO: 06035A180JAT4A
C11 = MyPassives:CAPACITOR: Standard SMD capacitor; PARTNO: C0603C224K4RECAUTO
C12 C15 C17 = MyPassives:CAPACITOR: Standard SMD capacitor; PARTNO: GRM1885C2A111JA01D
C18 C20 = MyPassives:CAPACITOR: Standard SMD capacitor; PARTNO: GRM1885C1H7R5DA01D
C19 C31 = MyPassives:CAPACITOR: Standard SMD capacitor; PARTNO: GRM1885C1H130JA01D
C22 C42 = MyPassives:CAPACITOR: Standard SMD capacitor; PARTNO: GRM1885C1H200JA01D
C23 = MyPassives:CAPACITOR: Standard SMD capacitor; PARTNO: GCM1885C2A160JA16D
C24 C25 = MyPassives:CAPACITOR: Standard SMD capacitor; PARTNO: GRM1885C2A240JA01D
C30 C37 = MyPassives:CAPACITOR: Standard SMD capacitor; PARTNO: GRM1885C1H470JA01J
C36 = MyPassives:CAPACITOR: Standard SMD capacitor; PARTNO: GRM1885C1H390JA01D
C39 = MyPassives:CAPACITOR: Standard SMD capacitor; PARTNO: GRM1885C1H560JA01D
C50 = avx-supercaps:BZ05CA103ZSB: AVX BestCap Supercapacitor; PARTNO: BZ05CA103ZSB
C52 C53 = MyPassives:CAPACITOR: Standard SMD capacitor; PARTNO: 06035A360JAT2A
D1 = MyDiodes:DIODE-SCHOTTKY: Standard SMD Schottky diode; PARTNO: BAT20JFILM
D3 = SparkFun-DiscreteSemi:DIODE-ZENER: Zener Diode Production Part - 8199 3.4V Zener Voltage; PARTNO: MM3Z12VST1G; PROD_ID: DIO-12442; VALUE: 5.6V
J$1 = SparkFun-Connectors:SMA_EDGE: SMA Antenna Connector End launch SMA connector. The paste layer has been removed so that the connector can be hand soldered onto the board after reflow.; DNP: T
JLINK = SparkFun-Connectors:M05: Header 5 Standard 5-pin 0.1" header. Use with straight break away headers (SKU : PRT-00116), right angle break away headers (PRT-00553), swiss pins (PRT-00743), machine pins (PRT-00117), and female headers (PRT-00115). Molex polarized connector foot print use with SKU : PRT-08230 with associated crimp pins and housings.; DNP: T
JP1 = SparkFun-Connectors:RJ45-8: RJ45 Jack Simple RJ45, 8-pin connection - connector for common Cat5, Cat5e, and Cat6 Ethernet cables. Footprint not yet proven in production. Connector sku is PRT-00643; Breakout PCB sku is BOB-00716.; PARTNO: ‎615008137121‎; PROD_ID: CONN-08506; VALUE: RJ45
L1 = MyPassives:INDUCTOR: Standard SMD inductor; PARTNO: LQW18AN47NG00D
L2 L12 = MyPassives:INDUCTOR: Standard SMD inductor; PARTNO: MLZ2012M4R7WT000
L3 = MyPassives:INDUCTOR: Standard SMD inductor; PARTNO: LQW18AN36NG00D
L4 = MyPassives:INDUCTOR: Standard SMD inductor; PARTNO: BRC2012T2R2MD
L5 L17 L24 = MyPassives:INDUCTOR: Standard SMD inductor; PARTNO: HK1608R47J-T
L6 = MyPassives:INDUCTOR: Standard SMD inductor; PARTNO: LQW18ANR13G00D
L7 = MyPassives:INDUCTOR: Standard SMD inductor; PARTNO: LQW18ANR10G00D
L8 L13 = MyPassives:INDUCTOR: Standard SMD inductor; PARTNO: LQW18ANR20J00D
L9 = MyPassives:INDUCTOR: Standard SMD inductor; PARTNO: LQW18AN18NG00D
L10 = MyPassives:INDUCTOR: Standard SMD inductor; PARTNO: LQW18AN22NJ00D
L11 = MyPassives:INDUCTOR: Standard SMD inductor; PARTNO: LQW18AN56NG00D
L14 = MyPassives:INDUCTOR: Standard SMD inductor; PARTNO: LQW18ASR12G0ZD
L15 = MyPassives:INDUCTOR: Standard SMD inductor; PARTNO: LQW18AN5N6G8ZD
L16 = MyPassives:INDUCTOR: Standard SMD inductor; PARTNO: LQW18AN6N8C10D
L18 L19 = MyPassives:INDUCTOR: Standard SMD inductor; PARTNO: MPZ1608S102ATA00
L20 = MyPassives:INDUCTOR: Standard SMD inductor; PARTNO: LQW18AN68NG00D
L23 = MyPassives:INDUCTOR: Standard SMD inductor; PARTNO: LQW18AN39NG00D
Q1 Q2 = transistor-small-signal:BSS84: P-CHANNEL MOS FET; PARTNO: DMP3099L-7
R1 = MyPassives:RESISTOR: Standard SMD resistor; PARTNO: RC0603FR-070RL
R2-R4 R7 = MyPassives:RESISTOR: Standard SMD resistor; PARTNO: RC0603JR-071K1L
R5 R9 R10 R12 R14-R16 R19 R23 = MyPassives:RESISTOR: Standard SMD resistor; PARTNO: RC0603JR-0710KL
R6 = MyPassives:RESISTOR: Standard SMD resistor; PARTNO: RC0603FR-07100RL
R11 = MyPassives:RESISTOR: Standard SMD resistor; PARTNO: RC0603JR-073KL
R22 = MyPassives:RESISTOR: Standard SMD resistor; PARTNO: RC0603JR-0722RL
S1 = c&k-switch:KMR221NGLFS: Miniature tactile switch, 4-lead SMD; DNP: T; PARTNO: KMR221NGLFS
U1 = diodesinc:AP63203: Low EMI buck converter; PARTNO: AP63203WU-7
U2 = PSA4-5043_:PSA4-5043+: Buy Part <https://snapeda.com/parts/PSA4-5043%2B/Mini-Circuits/view-part/?ref=eda>; AVAILABILITY: Warning; DESCRIPTION: Ultra Low Noise MMIC Amplifier, 50ohm, 0.05 to 4 GHz; MF: Mini-Circuits; MOUSER-PURCHASE-URL: https://snapeda.com/shop?store=Mouser&id=560261; MP: PSA4-5043+; PACKAGE: None; PARTNO: PSA4-5043+; PRICE: None
U3 = st-power:LDF: Low Noise Adjustable LDO (1A max); PARTNO: LDFPUR
U4 U9 = diodesinc:DMN63D8LDW: Dual N-Channel MOSFET; PARTNO: DMN63D8LDW-7
U5 = SparkFun-PowerIC:V_REG_LDO: Voltage Regulator LDO Standard 150mA LDO voltage regulator in SOT-23 layout. Micrel part MIC5205. BP (by-pass) pin is used to lower output noise with 470pF cap.; PARTNO: LP5907QMFX-1.8Q1
U6 = eeprom:24LC01B: 1KB I2C EEPROM; PARTNO: 24LC01BT-I/OT
U7 = nxp:AFT0SMS003N; PARTNO: AFT05MS003NT1
U8 = telit:SE873: Telit SE873 GNSS Receiver; PARTNO: SE873Q5
U10 = johanson-technology:1575AT43A0040E: SMD Ceramic GNSS Antenna; PARTNO: 1575AT43A0040E
U11 U12 = EZRadioPRO:SI4463; PARTNO: SI4463-C2A-GMR
U13 = stm32:STM32L432KXXX; PARTNO: STM32L412K8U6
U15 = skyworks:SKYWORKS-13330397LF: SP2T RF Switch; PARTNO: SKY13330-397LF
U16 = rfmi:SF2147D: 157.0 MHz SAW filter; PARTNO: SF2147D
X1 X2 = adafruit:XTAL-4: Classic 4-pin 3.2 x 2.5mm crystal; PARTNO: CX3225SB30000D0FPLCC

## Board
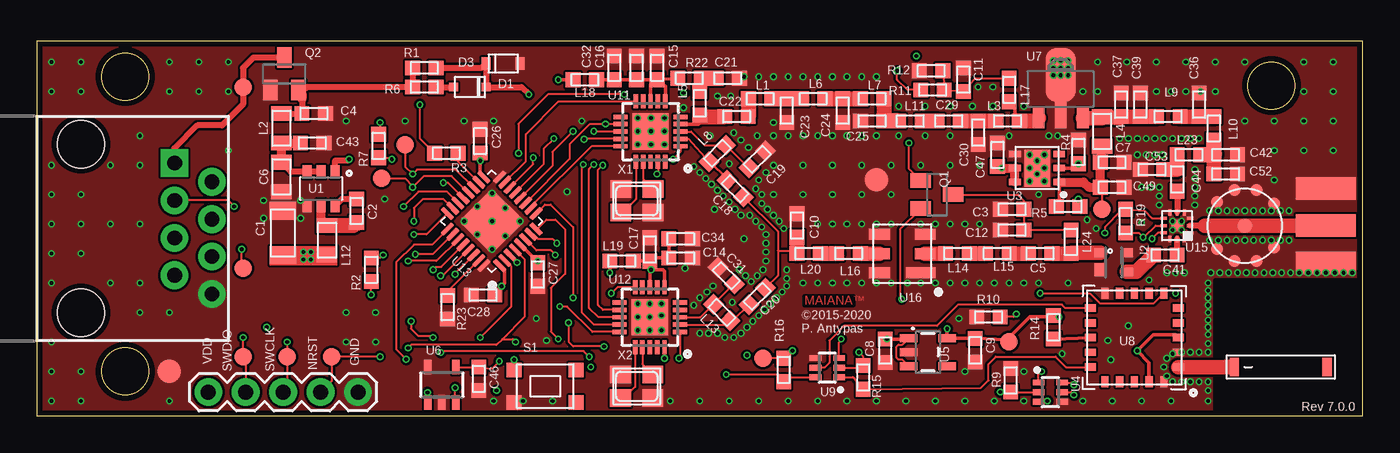
[diagram p7: board, top side]
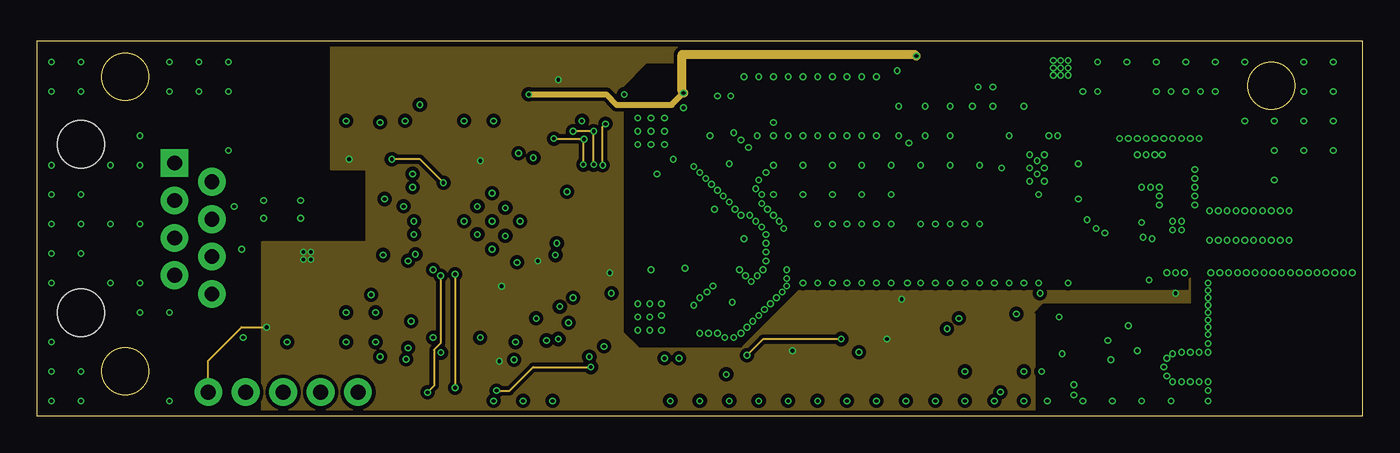
[diagram p8: board, inner layer Layer2]
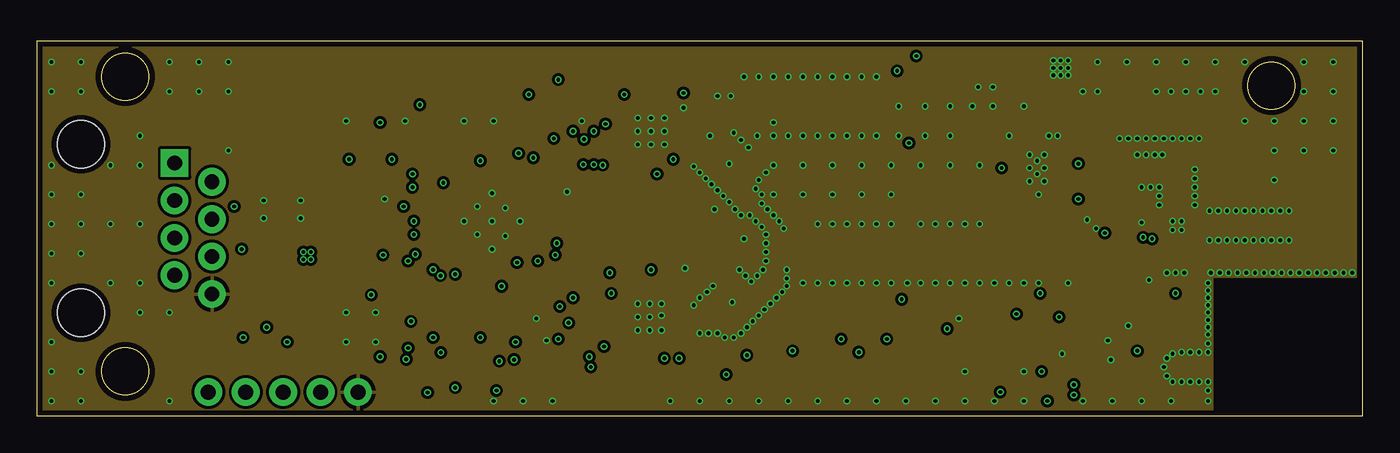
[diagram p9: board, inner layer Layer3]
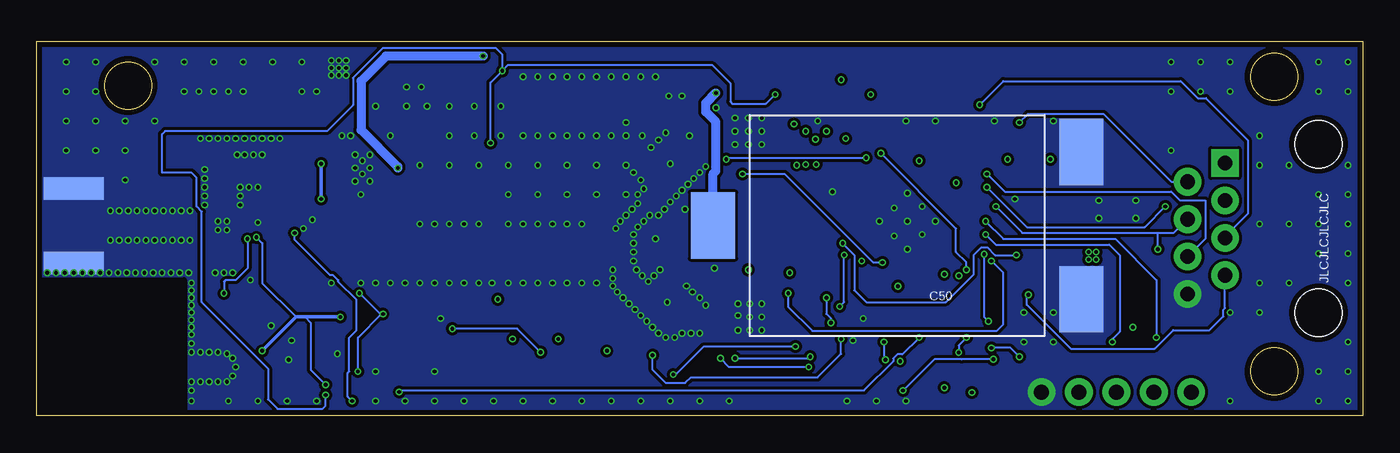
[diagram p10: board, bottom side, seen from below]

Size 90 x 25.4 mm. Coordinates in mm from the lower left corner, seen from the top.
Outline: 0,0 90,0 90,25.4 0,25.4 0,0
Outline: circle at 83.8,22.4 radius 1.6
Outline: circle at 6,3 radius 1.6
Outline: circle at 6,23 radius 1.6
Copper layers (1+2*15+16): Top 0.035mm / dielectric 0.17mm / Layer2 0.018mm / dielectric 1.2mm / Layer3 0.018mm / dielectric 0.17mm / Bottom 0.035mm
Design rules "default *": minimum track width 5mil, minimum drill 10mil, track to track 6mil, track to pad 6mil, pad to pad 6mil, via to via 6mil, smd to smd 0mil, copper to edge 15mil, drill to drill 6mil, minimum pad ring 4mil, minimum via ring 4mil, stop-mask expansion 0mil, vias tented up to drill 20mil, thermal gap 10mil
tRestrict: area 80,0 to 90.2,9.2
bRestrict: area 80,0 to 90.2,9.2

### Footprints (pad centres in the part's own frame; a part is rotated, then mirrored left to right if it is on the bottom)
TP12R = smd 1.2 x 1.2: TP 0,0
1206 = smd 1.2 x 1.8: P$1 -1.5,0; P$2 1.5,0
0603 = smd 1 x 1: P$1 -0.8,0; P$2 0.8,0
0805 = smd 1 x 1.4: P$1 -1,0; P$2 1,0
BZ05 = smd 3 x 4.5: P$1 -12.5,5; P$2 -12.5,-5; P$3 12.5,0
SOD323 = smd 0.6 x 0.6: A 1.1,0; C -1.1,0
SOD-323 = smd 0.63 x 0.83: A 1.15,0; C -1.15,0
TP16R = smd 1.6 x 1.6: TP 0,0
SMA-EDGE = smd 1.524 x 4.064: GND@0 0,0; GND@1 5.08,0; SIG 2.54,0 | smd 1.524 x 4.064 bottom: GND@2 0,0; GND@3 5.08,0
1X05 = drill 1.016 pad 1.88: 1 0,0; 2 2.54,0; 3 5.08,0; 4 7.62,0; 5 10.16,0
RJ45-8 = drill 1 pad 1.88 square: 1 -4.445,6.35 | drill 1 pad 1.88: 2 -3.175,8.89; 3 -1.905,6.35; 4 -0.635,8.89; 5 0.635,6.35; 6 1.905,8.89; 7 3.175,6.35; 8 4.445,8.89 | hole 3.2: -5.715,0; 5.715,0
SOT23 = smd 1 x 1.4: 1 -0.95,-1.1; 2 0.95,-1.1; 3 0,1.1
KMR221NGLFS = smd 1 x 1: P$1 -2.1,1.1; P$2 -2.1,-1.1; P$3 2.1,-1.1; P$4 2.1,1.1
TP10R = smd 1 x 1: TP 0,0
TP08R = smd 0.8 x 0.8: TP 0,0
SOT23-6 = smd 0.6 x 0.9: 1 -0.95,-1.15; 2 0,-1.15; 3 0.95,-1.15; 4 0.95,1.15; 5 0,1.15; 6 -0.95,1.15
PSA4-5043+ = smd 0.6 x 0.8: 1 -0.65,-0.9; 3 0.65,0.9; 4 -0.65,0.9 | smd 0.9 x 0.8: 2 0.5,-0.9
DFN-6 = smd 0.8 x 0.45: P$1 -1.5,0.95; P$2 -1.5,0; P$3 -1.5,-0.95; P$4 1.5,-0.95; P$5 1.5,0; P$6 1.5,0.95 | smd 1.75 x 2.5: P$7 0,0
SOT363 = smd 0.4 x 0.8: 1 -0.65,-0.8; 2 0,-0.8; 3 0.65,-0.8; 4 0.65,0.8; 5 0,0.8; 6 -0.65,0.8
SOT23-5 = smd 0.55 x 1.2: 1 -0.95,-1.3; 2 0,-1.3; 3 0.95,-1.3; 4 0.95,1.3; 5 -0.95,1.3
SOT23-5' = smd 0.5 x 1: 1 -0.95,-1.2; 2 0,-1.2; 3 0.95,-1.2; 4 0.95,1.2; 5 -0.95,1.2
SOT-89 = smd 0.8 x 1.4: 1 -1.499,-1.981; 3 1.499,-1.981 | smd 0.8 x 1.9: 2 0,-1.727 | smd 2.032 x 3.65: 2@1 0,0.94
SE873 = smd 0.75 x 0.5: P$1 -3,2; P$2 -3,1; P$3 -3,0; P$4 -3,-1; P$5 -3,-2; P$11 3,-2; P$12 3,-1; P$13 3,0; P$14 3,1; P$15 3,2 | smd 0.5 x 0.75: P$6 -2,-3; P$7 -1,-3; P$8 0,-3; P$9 1,-3; P$10 2,-3; P$16 2,3; P$17 1,3; P$18 0,3; P$19 -1,3; P$20 -2,3
1575AT43A0040E = smd 0.635 x 1.27: P$1 -3.2,0; P$2 3.1,0
SI4463 = smd 0.95 x 0.3: 1 -2.05,1; 2 -2.05,0.5; 3 -2.05,0; 4 -2.05,-0.5; 5 -2.05,-1; 11 2.05,-1; 12 2.05,-0.5; 13 2.05,0; 14 2.05,0.5; 15 2.05,1 | smd 0.3 x 0.95: 6 -1,-2.05; 7 -0.5,-2.05; 8 0,-2.05; 9 0.5,-2.05; 10 1,-2.05; 16 1,2.05; 17 0.5,2.05; 18 0,2.05; 19 -0.5,2.05; 20 -1,2.05 | smd 2.45 x 2.45: EXP 0,0
QFN32 = smd 1 x 0.3: 1 -2.5,1.75; 2 -2.5,1.25; 3 -2.5,0.75; 4 -2.5,0.25; 5 -2.5,-0.25; 6 -2.5,-0.75; 7 -2.5,-1.25; 8 -2.5,-1.75; 17 2.5,-1.75; 18 2.5,-1.25; 19 2.5,-0.75; 20 2.5,-0.25; 21 2.5,0.25; 22 2.5,0.75; 23 2.5,1.25; 24 2.5,1.75 | smd 0.3 x 1: 9 -1.75,-2.5; 10 -1.25,-2.5; 11 -0.75,-2.5; 12 -0.25,-2.5; 13 0.25,-2.5; 14 0.75,-2.5; 15 1.25,-2.5; 16 1.75,-2.5; 25 1.75,2.5; 26 1.25,2.5; 27 0.75,2.5; 28 0.25,2.5; 29 -0.25,2.5; 30 -0.75,2.5; 31 -1.25,2.5; 32 -1.75,2.5 | smd 3.2 x 3.2: EXP 0,0
QFN12 = smd 0.44 x 0.2: P$1 -0.9,0.5; P$2 -0.9,0; P$3 -0.9,-0.5; P$7 0.9,-0.5; P$8 0.9,0; P$9 0.9,0.5 | smd 0.2 x 0.44: P$4 -0.5,-0.9; P$5 0,-0.9; P$6 0.5,-0.9; P$10 0.5,0.9; P$11 0,0.9; P$12 -0.5,0.9 | smd 0.76 x 0.76: P$13 0,0
SAW_FILTER1 = smd 2 x 0.75: P$1 -1.2,1.3 | smd 1.4 x 0.75: P$2 -1.5,0; P$3 -1.5,-1.3; P$4 1.6,-1.3; P$5 1.6,0; P$6 1.6,1.3
NX3225 = smd 1.4 x 1.2: 1 -1.1,-0.8; 2 1.1,-0.8; 3 1.1,0.8; 4 -1.1,0.8

### Placement (x,y rotation side)
1V8  66,5 0 top
3V3  49.3,3.9 0 top
C1  16.7,12.4 90 top
C2  21.7,13.9 270 top
C3  66.2,14 180 top
C4  18.8,20.5 0 top
C5  68.1,11 180 top
C6  16.6,16.2 270 top
C7  73,17.2 0 top
C8  57.59,4.41 270 top
C9  63.7,4.44 270 top
C10  51.6,12.9 270 top
C11  62.9,22.8 90 top
C12  66.2,12.6 0 top
C14  43.7,10.7 0 top
C15  42.1,23.6 90 top
C16  40.7,23.6 90 top
C17  41.6,11.28 90 top
C18  47.4,15.4 315 top
C19  48.9,17.4 225 top
C20  48.9,8.1 45 top
C21  46.9,22.9 0 top
C22  47.5,20.3 0 top
C23  50.9,20.7 270 top
C24  54.7,20.7 270 top
C25  56.7,20 180 top
C26  30.09,18.63 90 top
C27  34.01,9.58 270 top
C28  30.29,8.19 180 top
C29  61.9,20 0 top
C30  63.9,19.2 270 top
C31  46.8,9.5 315 top
C32  39.2,23.6 90 top
C34  43.7,12 0 top
C36  78.9,21.1 90 top
C37  73.6,21.1 90 top
C39  74.9,21.1 90 top
C41  76.6,10.9 180 top
C42  80.7,17.7 0 top
C43  18.7,18.5 0 top
C44  77.41,16.03 270 top
C46  30,2.5 270 top
C47  65.2,17.7 90 top
C49  73,15.5 0 top
C50  31.6,12.9 180 bottom
C52  80.7,16.4 0 top
C53  75.7,16.7 180 top
D1  29.4,22.3 180 top
D3  31.65,23.9 0 top
GND1  57,16 0 top
GND2  9,3 0 top
J$1  87.5,10.35 90 top
JLINK  21.8,1.6 180 top
JP1  3,12.7 270 top
L1  49.1,21.5 0 top
L2  16.6,19.5 270 top
L3  65.9,20 0 top
L4  72.31,19.29 90 top
L5  45,21.2 270 top
L6  52.7,21.5 0 top
L7  56.7,21.5 0 top
L8  46.2,17.8 45 top
L9  76.8,20.3 0 top
L10  79.9,19.5 270 top
L11  59.3,20 0 top
L12  19.7,11.9 270 top
L13  46.5,7 135 top
L14  62.5,11 0 top
L15  65.2,11 0 top
L16  55.1,11 0 top
L17  66,22.1 90 top
L18  37.2,22.8 0 top
L19  39.7,10.5 0 top
L20  52.4,11 0 top
L23  78.2,17.7 180 top
L24  70.2,11.8 270 top
NRST  20,4 0 top
Q1  61.1,15 270 top
Q2  16.8,23.2 0 top
R1  26.3,23.6 0 top
R2  22.7,9.9 90 top
R3  27.8,17.8 180 top
R4  70.7,17.9 270 top
R5  70,14.2 180 top
R6  26.3,22.3 0 top
R7  23.2,18.3 90 top
R9  66.1,2.4 270 top
R10  64.6,6.7 0 top
R11  60.8,22.1 180 top
R12  60.7,23.4 0 top
R14  69,6 90 top
R15  56.1,2.6 90 top
R16  50.7,3.1 90 top
R19  73.9,13.2 270 top
R22  44.3,22.9 180 top
R23  27.89,7.36 270 top
RX  23.4,16.1 0 top
S1  34.5,2 0 top
SWCLK  17,4 0 top
SWDIO  14,4 0 top
TP1  82,12.9 0 top
TP2  81.3,15.3 0 top
TP3  81.3,10.5 0 top
TP4  82.8,15.3 0 top
TP5  84,14.4 0 top
TP6  80.1,11.3 0 top
TP7  82.8,10.5 0 top
TP8  80.1,14.5 0 top
TP9  84,11.4 0 top
TX  25,18.4 0 top
TX_OFF  14,10 0 top
U1  19.3,15.4 180 top
U2  73.1,10.4 270 top
U3  67.9,16.8 180 top
U4  68.8,1.6 270 top
U5  60.49,4.31 270 top
U6  24LC01B  [SOT23-5']  27.5,2.1 0 top
U7  69.5,22.18 0 top
U8  74.5,5.3 180 top
U9  53.66,3.26 90 top
U10  84.49,3.3 0 top
U11  41.66,19.28 180 top
U12  41.61,6.68 180 top
U13  30.88,13.19 135 top
U15  77.4,12.9 180 top
U16  58.8,11 180 top
V_BAT  14,22.3 0 top
V_PA  72.3,14 0 top
X1  40.73,14.59 0 top
X2  40.72,1.99 0 top

### Tracks (layer width: path | path; a pad name or v marks a point on that pad's centre or on a via)
1V8  (via drill 0.25)
  Top 0.152: U9.2 55.96,3.26 R15.P$2 56.1,4 v55.8,4.3 | R19.P$2 74.79,12.4 v75.09,12.1 75.15,12.1 75.95,12.9 U15.P$8 | U4.6 70.25,2.25 v70.4,2.1 | 1V8.TP 65.85,5.15
  Top 0.254: U8.P$3 77.3,5.5 75.8,5.5 v74.7,4.4 75.5,3.6 U8.P$19 | v69.4,6.7 69.3,6.8 R14.P$2 68.9,6.7 67.4,6.7 65.85,5.15 65.84,5.14 C9.P$1 63.58,5.26 U5.5 v61.79,5.9
  Bottom 0.152: v55.8,4.3 57.4,5.9 v61.79,5.9 | 71.8,6.7 71.4,6.3 71.4,3.1 v70.4,2.1 | v75.09,12.1 74.69,11.7 74.69,8.99 72.4,6.7
  Bottom 0.254: v69.4,6.7 71.8,6.7 72.4,6.7 v74.7,4.4
3.3V  (via drill 0.25)
  Top 0.152: v57.7,5.2 57.61,5.11 C8.P$1 | U6.4 C46.P$1 30.9,3.2 v31.4,3.7 | U5.3 58.74,3.81 58.49,3.81 58.36,3.94 58.36,4.68 58.49,4.81 58.74,4.81 U5.1 | U15.P$9 76.1,12.4 v75.7,12 | R16.P$2 3V3.TP | Q1.2 58.6,12.65 58.6,8 v58.7,7.9
  Top 0.254: R16.P$2 51.2,4.4 v51.3,4.4 | U13.17 30.1,16.45 v30.1,17.3 30.1,17.48 C26.P$1 | U13.5 34.01,10.41 C27.P$1 34,10.29 v34,10.5 | U13.1 31.75,9.85 31.75,8.98 v31.55,8.78 31.55,8.75 C28.P$1 | U5.1 59.13,5.2 v57.7,5.2 | L18.P$1 v35.4,22.8 | L19.P$1 v38.9,9.7
  Top 0.406: C1.P$1 18.1,10.9 | 18.1,10.9 L12.P$2 | 18.1,10.9 v18.1,10.6 | U1.1 20.25,17.3 21.1,17.3 v21.2,17.4
  Layer2 0.152: JLINK.5 11.64,3.74 13.9,6 v15.6,6
  Bottom 0.152: v75.7,12 75.7,10 76.5,9.2 77.2,9.2 77.3,9.1 v77.3,8.3
  other vias: 18.6,11.1 18.1,11.1 18.6,10.6
  pour Layer2 (isolate 0.25): 78.4,28.5 78.25,7.66 68.26,7.66 67.61,7 67.7,6.91 67.7,-3.48 15.3,-3.48 15.3,11.8 22.4,11.8 22.4,16.7 19.99,16.7 19.99,28.5
  cutout Layer2: 39.9,22.3 39.9,5.7 40.9,4.7 47.8,4.7 51.7,8.6 78.12,8.6 78.12,23.8 41.4,23.8
AIS_RX_EVT  (via drill 0.25)
  Top 0.152: v22.7,8.2 R2.P$1
  Bottom 0.152: JP1.7 9.35,7.3 9.46,7.19 9.46,6.74 10.4,5.8 12.85,5.8 14.11,4.54 19.82,4.54 22.8,7.52 22.8,8.11 v22.7,8.2
AIS_TX_EVT  (via drill 0.25)
  Top 0.152: R3.P$2 26,18.8 v26,21.1
  Bottom 0.152: v26,21.1 24.4,22.7 12.35,22.7 11.19,21.54 10.64,21.54 7.8,18.7 7.8,13.7 9.35,12.15 JP1.5
BOOT0
  Top 0.152: U13.31 27.89,8.43 27.89,8.1 R23.P$1
BST
  Top 0.406: C2.P$1 20.7,14.7 U1.6
CS1
  Top 0.152: U11.15 37.64,18.28 33.53,14.17 U13.10
CS2  (via drill 0.25)
  Top 0.152: U12.15 37.72,5.68 36,7.4 v35.5,7.4 | v35.2,10.9 34.89,11.21 33.92,11.21 U13.6
  Bottom 0.152: v35.2,10.9 35.2,7.7 v35.5,7.4
GND  (via drill 0.25)
  other vias: 77.9,9.7 77.3,9.7 69.5,23.1 69.5,23.6 69.5,24.1 70,23.1 70,23.6 70,24.1 69,24.1 69,23.6 69,23.1 79.5,1.7 71,1 31,1 56,17 54,17 52,17 56,15 58,15 30.9,13.2 31.8,12.2 29.9,14.2 29,13.2 30.9,15.1 30.9,11.3 32.8,13.2 29.9,12.3 31.8,14.1 41.6,6.7 41.6,5.8 41.6,7.6 42.4,7.6 42.4,6.8 42.4,5.8 40.8,5.8 40.8,6.7 40.8,7.6 41.7,19.3 41.7,18.4 41.7,20.2 42.6,20.2 42.6,19.3 42.6,18.4 40.8,18.4 40.8,19.3 40.8,20.2 49,1 47,1 45,1 43,1 49,23 51,23 74.1,6.1 72.7,5.1 79.5,7 79.5,9 79.5,8 79.5,6 79.5,4.9 82.1,9.7 82.7,9.7 83.3,9.7 85.1,9.7 85.7,9.7 86.3,9.7 86.9,9.7 87.5,9.7 88.1,9.7 88.7,9.7 81.5,9.7 79.5,8.5 79.5,7.5 79.5,6.5 79.5,5.5 79.5,2.3 77.1,4.2 77.7,4.3 78.3,4.3 78.9,4.3 79.5,4.3 78.9,2.3 78.3,2.3 77.7,2.3 76.7,2.7 76.7,3.9 76.5,3.3 83.9,9.7 84.5,9.7 79.5,1 34.6,5.1 72.9,3.8 69.6,4.2 33,1 35,1 37,20 29,20 44,10 23.6,14.7 1,1 3,1 3,3 1,3 1,11 1,13 1,17 1,24 13,24 1,22 50,17 50,15 52,15 47.8,18.7 47.3,19.2 47.1,21.7 46.2,21.7 43.9,20.9 50.6,8.4 50.2,8 49.8,7.6 49.4,7.2 49,6.8 48.6,6.4 48.2,6 47.8,5.6 47.3,5.3 46.7,5.3 46.2,5.6 45.6,5.6 45,5.6 49.6,14 49.2,14.4 49.2,15 48.8,15.4 47,17.1 49,16 49.5,16.5 48.4,13.6 48.8,13.2 49.2,12.8 49.3,9.9 48.9,9.5 48.5,9.1 47.2,7.7 47.8,13.6 47.4,14 47,14.5 46.6,14.9 46.2,15.3 45.8,15.7 45.4,16.1 45,16.5 44.6,16.9 48.1,9.5 47.7,9.9 45.9,8.8 45.5,8.4 45,8 44.6,7.5 46,14 48,12 54,15 25,20 23,5 23,7 53,23 55,23 57,23 50,19 52,19 54,19 48.3,18.2 45.7,19 56,19 55,19 53,19 51,19 50,23 52,23 54,23 56,23 67,21 50,19.9 48.9,19 36,15.2 33.9,6.6 82,24 80,24 78,24 76,24 74,24 72,24 72,22 76,22 78,22 80,22 79,22 77,22 71,22 62,17 62,19 64,17 66,19 64.9,21 48,23 58.5,19 58.5,21 51,1 53,1 55,1 57,1 59,1 61,1 63,1 65,1 67,1 73,1 75,1 77,1 68,15 76.2,14.9 57,19 58,17 60,17 60.3,19 67.4,15.9 68.4,15.9 67.4,16.8 67.4,17.7 68.4,17.7 68.4,16.8 67.9,16.4 67.9,17.3 73.5,18.8 74.1,18.8 74.7,18.8 75.3,18.8 75.9,18.8 76.5,18.8 77.1,18.8 77.7,18.8 78.3,18.8 78.9,18.8 78.6,16.7 78.6,16.1 76.2,15.5 78.6,15.5 76.2,14.3 78.6,14.9 82,20 89.3,9.7 3,24 3,22 1,9 1,15 3,15 3,13 3,11 5,9 7,9 5,13 7,13 5,17 7,17 7,19 7,7 9,7 9,1 1,5 50,13.6 49.5,12.3 49.5,11.7 49.5,11.1 49.5,10.5 50.9,9.9 50.9,9.3 50.4,13.2 71.3,13.3 71.9,12.7 54,9 52,9 56,9 58,9 60,9 62,9 64,9 68,9 70,9 60.3,21 62,21 68.7,19 69.3,19 63.5,21 64.9,22.3 63.9,22.3 66,9 80.9,9.7 80.3,9.7 79.7,9.7 77.1,13.2 77.7,13.2 77.1,12.6 77.7,12.6 77.1,2.3 78.6,14.3 76.7,9.7 79.6,13.9 80.2,13.9 80.8,13.9 81.4,13.9 82,13.9 82.6,13.9 83.2,13.9 83.8,13.9 84.4,13.9 85,13.9 79.6,11.9 80.2,11.9 80.8,11.9 81.4,11.9 82,11.9 82.6,11.9 83.2,11.9 83.8,11.9 84.4,11.9 85,11.9 74.7,17.7 75.3,17.7 75.9,17.7 76.4,17.7 75.6,15.5 75,15.5 86,24 88,24 88,22 86,22 86,20 88,20 88,18 86,18 84,20 84,18 84,16 75,13.1 31,20 62.6,6.6 13,18 9,24 11,24 63,3 67,3 50.9,8.8 21,7 21,5 15.4,14.6 17.9,14.6 17.9,13.4 15.4,13.4 9,22 11,22 13,22 21,20 75.5,9.2 63,9 65,9 67,9 53,9 55,9 57,9 59.1,9 61,9 61,13 62,13 63,13 64,13 60,13 58,13 57,13 56,13 55,13 54,13 53,13 50.7,12.7
  pour Top (isolate 0.16, no thermals): -1,26 92.2,26 92.2,-0.9 -1,-0.9
  pour Bottom (isolate 0.2, no thermals): -3,28 93,28 93,-3 -3,-3
  pour Layer3 (isolate 0.2): -1.6,27 91.3,27 91.3,9.4 79.8,9.4 79.8,-2.4 -1.6,-2.4
GNSS_1PPS
  Top 0.152: U9.5 53.46,3.26 53.8,3.6 53.8,5.1 54.8,6.1 61.1,6.1 62.53,7.53 69.59,7.53 69.82,7.3 U8.P$11
GNSS_EN  (via drill 0.25)
  Top 0.152: U13.2 31.79,10.54 32.21,10.12 32.21,7.41 v30.1,5.3 | v65.4,1.6 R9.P$2 U4.2
  Bottom 0.152: v30.1,5.3 31.24,4.16 31.59,4.16 31.86,3.89 31.86,3.7 33.84,1.72 65.28,1.72 v65.4,1.6
GNSS_EN_1V8  (via drill 0.25)
  Top 0.152: v68.1,8.3 71.49,8.3 72.17,7.62 75.82,7.62 U8.P$6 | v66.5,6.9 66.3,6.7 R10.P$2 | U4.1 68,2.8 v68.2,3
  Bottom 0.152: v68.1,8.3 66.7,6.9 66.6,6.9 | 66.6,6.9 v66.5,6.9 | v68.2,3 68.2,5.3 66.6,6.9
GNSS_STATE  (via drill 0.25)
  Top 0.152: v23.3,19.9 23.3,19.2 R7.P$2
  Bottom 0.152: JP1.2 13,15.88 17.58,20.46 22.74,20.46 v23.3,19.9
GNSS_UART_TX
  Top 0.152: U9.1 55.39,2.61 R15.P$1 64.1,1.9 64.6,2.4 64.6,3.5 65.1,4 69.15,4 69.85,3.3 U8.P$15
I2C_SCL  (via drill 0.25)
  Top 0.152: U13.29 27.54,9.5 v27.4,9.5 | U6.1 26.52,0.93 v26.52,1.58
  Layer2 0.152: v27.4,9.5 27.4,4.9 26.96,4.47 26.96,2.02 v26.52,1.58
I2C_SDA  (via drill 0.25)
  Top 0.152: U13.30 28.4,9.65 v28.4,9.6 | U6.3 28.4,0.95 v28.4,1.9
  Layer2 0.152: v28.4,9.6 v28.4,1.9
MCU_GNSS_1PPS  (via drill 0.25)
  Top 0.152: U13.8 33.96,12.66 34.6,13.3 35.2,13.3 35.86,12.64 35.86,9.63 34.9,8.67 34.9,5.7 v35.4,5.2 | v54.6,5.2 54.64,5.16 54.46,4.98 U9.3
  Layer2 0.152: v54.6,5.2 49.3,5.2 v48.2,4.1
  Bottom 0.152: v48.2,4.1 48.2,3.1 47.32,2.22 45.98,2.22 45.6,2.6 37,2.6 35.4,4.2 v35.4,5.2
MCU_GNSS_UART_RX  (via drill 0.25)
  Top 0.152: U13.9 34.48,14.32 34.88,14.32 36.4,12.8 v36.4,8 | v46.8,2.8 50.3,2.8 R16.P$1 50.91,2.61 U9.6 | v36.1,6.3 36.1,5 36.4,4.7 v38.5,4.7
  Bottom 0.152: v46.8,2.8 46.6,2.8 44.7,4.7 v38.5,4.7 | v36.4,8 36.4,6.9 36.1,6.6 v36.1,6.3
MCU_UART_RX  (via drill 0.25)
  Top 0.152: U13.20 28.16,16.26 26.26,16.26 25.55,15.55 | 25.55,15.55 v25.5,15.5 | v13.4,14.2 13,14.6 JP1.3 | RX.TP 25,16.1 25.55,15.55
  Bottom 0.152: v25.5,15.5 22.8,12.8 14.8,12.8 v13.4,14.2
MCU_UART_TX  (via drill 0.25)
  Top 0.152: U13.19 28.43,16.7 25.8,16.7 v25.5,16.4 25,16.9 TX.TP
  Bottom 0.152: v25.5,16.4 24.3,15.2 13,15.2 12.4,14.6 10.68,14.6 10.68,12 JP1.6
MISO  (via drill 0.25)
  Top 0.152: U11.13 37.82,19.28 v37.8,19.3 | v36.4,19.3 35,17.9 35,16.96 U13.12 | U12.13 38.12,6.68 37.5,7.3 37.5,16.74 v37.8,17.04
  Layer2 0.152: v36.4,19.3 v37.8,19.3 v37.8,17.04
MOSI  (via drill 0.25)
  Top 0.152: U11.14 37.18,18.78 v37.15,18.75 | U13.13 34.4,17.06 34.4,18.1 v35.1,18.8 | U12.14 37.82,6.18 37,7 37,16.94 v37.1,17.04
  Layer2 0.152: v35.1,18.8 37.1,18.8 v37.15,18.75 37.1,18.7 v37.1,17.04
N$1
  Top 0.254: C15.P$1 C16.P$1 C32.P$1 L18.P$2 | C15.P$1 R22.P$2 | C15.P$1 41.66,22.46 U11.8 | U11.6 42.66,22.34 C15.P$1
N$2
  Top 0.406: R6.P$2 D1.A
N$3
  Top 0.127: C19.P$2 48.3,16.83 L8.P$2 45.33,18.37 44.42,19.28 U11.3
N$4
  Top 1: L14.P$1 U16.P$2
N$5
  Top 1: C41.P$2 74.65,9.75 U2.3
N$6
  Top 0.127: U11.2 44.23,18.78 L8.P$1 46.91,16.11 C18.P$1
N$7
  Top 1.016: L6.P$2 C24.P$1 L7.P$1
N$8
  Top 0.152: R12.P$2 R11.P$1 C11.P$1 63.7,22.9 L17.P$2
N$9
  Top 1: L15.P$1 L14.P$2
N$10
  Top 0.508: 80.6,3.3 U10.P$1
  Top 1: U8.P$1 80.6,3.3
N$11
  Top 1.016: L7.P$2 C25.P$1 L11.P$1
N$12
  Top 1.016: L1.P$2 C23.P$1 L6.P$1
N$13
  Top 0.254: R14.P$1 U8.P$13
N$14  (via drill 0.25)
  Top 0.254: U12.8 41.61,9.81 v41.7,9.9 | U12.6 42.61,9.79 42.5,9.9 v41.7,9.9 | 41.69,10.69 41.7,10.68 v41.7,9.9 | 41.69,10.69 41.7,10.7 C14.P$1 C34.P$1 | 41.69,10.69 41.59,10.59 C17.P$1 41.58,10.5 L19.P$2
N$15
  Top 0.152: TP1.TP 82.29,12.89 80.8,12.89
  Top 0.406: 79.3,12.9 U15.P$2
  Top 1: J$1.SIG 80.8,12.89 79.31,12.89 79.3,12.9
N$16
  Top 0.152: X2.1 39.84,1.19 40.61,1.96 U12.16
N$17
  Top 0.152: U12.17 41.11,3.5 X2.3
N$18
  Top 0.152: X1.1 39.75,13.79 40.66,14.7 U11.16
N$19
  Top 0.152: U11.17 41.16,16.06 X1.3
N$20
  Top 0.127: U12.2 46.67,6.18 L13.P$1 47.3,6.5 C20.P$1
N$21
  Top 0.127: U12.3 45.05,6.68 L13.P$2 47.3,8.93 C31.P$2
N$22
  Top 1: U2.1 70.25,11.05 L24.P$2 C5.P$1
N$23
  Top 0.61: 72.3,20.2 L4.P$2 | 73.55,20.19 C37.P$1
  Top 1: U7.3 72.3,20.2 | L4.P$2 73.55,20.19 | C37.P$1 C39.P$1 L9.P$1
N$24
  Top 0.254: U11.4 44.91,19.78 45,19.87 L5.P$2
  Top 1.016: L5.P$2 45.1,20.3 C22.P$1
N$25
  Top 1: C5.P$2 L15.P$2
N$26
  Top 0.254: L17.P$1 66.4,20.9 66.4,20 L3.P$2
  Top 1.016: L3.P$2 67.8,20 U7.1
N$27
  Top 0.406: U1.2 U1.3 17.25,16.55 C6.P$1
  Top 0.61: C43.P$1 L2.P$2 C6.P$1
N$28
  Top 1: L9.P$2 C36.P$1 L10.P$1
N$29
  Top 1.016: L3.P$1 C30.P$1 C29.P$2
N$30
  Top 0.406: C21.P$1 R22.P$1 L5.P$1
N$31
  Top 1.016: L1.P$1 C22.P$2
N$32  (via drill 0.25)
  Top 0.254: R5.P$1 v70.7,14.7 | U3.P$2 70.4,16.8 R4.P$2
  Bottom 0.254: R4.P$2 v70.7,14.7
  other vias: 70.7,17.1
N$33
  Top 1: U16.P$5 L16.P$2
N$34
  Top 1: L16.P$1 L20.P$2
N$35  (via drill 0.25)
  Top 0.152: U13.7 33.7,12.31 34.02,11.99 35.01,11.99 v35.3,11.7 | v23.5,10.9 23.3,10.7 R2.P$2
  Bottom 0.152: v35.3,11.7 34.5,10.9 34.5,8.5 33.7,7.7 28.3,7.7 26.4,9.6 26.4,10.9 25.89,11.41 25.47,11.41 24.95,10.9 v23.5,10.9
N$36
  Top 0.152: U13.18 28.6,17.24 R3.P$1
N$37  (via drill 0.25)
  Top 0.152: U13.21 27.91,15.8 v27.6,15.8 | R7.P$1 24,17.5 v24.1,17.4
  Layer2 0.152: v27.6,15.8 26,17.4 v24.1,17.4
N$40
  Top 0.254: L23.P$1 79.03,17.73
  Top 1: C42.P$1 79.97,17.73 79.03,17.73 | C42.P$1 L10.P$2 | C42.P$1 C52.P$1
N$41
  Top 0.254: C44.P$1 77.38,16.7 | L23.P$2
  Top 1: 77.38,16.7 C53.P$1 | L23.P$2 C44.P$1
NRST  (via drill 0.25)
  Top 0.152: U13.4 33.1,10.62 33.1,6.7 31.6,5.2 | v25.2,4.6 25.4,4.8 31.2,4.8 31.6,5.2 | v23.3,4 NRST.TP 20,2.34 JLINK.2 | 31.6,5.2 32.3,5.2 v32.5,5 | S1.P$1 v32.4,3.8
  Bottom 0.152: v23.3,4 23.9,4.6 v25.2,4.6 | v32.5,5 32.5,3.9 v32.4,3.8
PA_IN
  Top 1.016: L11.P$2 C29.P$1
PA_OUT
  Top 0.254: U15.P$5
  Top 0.406: C44.P$2 U15.P$5
RF_IN
  Top 0.406: U15.P$11 C41.P$1
RX_EN  (via drill 0.25)
  Top 0.152: U15.P$7 75.7,13.4 75.2,13.9 R19.P$1 73.6,13.9 72.5,12.8 v72.5,12.4 | U4.3 68.55,0.95 v68.6,1
  Bottom 0.152: v68.6,1 68.9,1.3 68.9,2.9 68.8,3 68.8,5.3 68.3,5.8 68.3,7.85 69.54,9.1 69.54,9.19 69.9,9.54 70.09,9.54 72.5,11.95 v72.5,12.4
RX_IC_CLK  (via drill 0.25)
  Top 0.152: U13.26 26.88,10.96 v25.7,10.96 | v27.42,4.28 27.52,4.38 37.12,4.38 v37.5,4 | U12.20 v42.61,3.91 v42.6,3.9 | v25.4,6.4 25.4,5.9 25.9,5.4 26.8,5.4 v26.9,5.3
  Bottom 0.152: v42.6,3.9 37.6,3.9 v37.5,4 | v25.7,10.96 25.7,6.7 v25.4,6.4 | v26.9,5.3 27.42,4.78 v27.42,4.28
RX_IC_DATA  (via drill 0.25)
  Top 0.152: U13.27 27.13,10.5 v25.2,10.5 | U12.10 39.43,8.73 v39,8.3
  Bottom 0.152: v39,8.3 39,7.4 37.36,5.76 24.84,5.76 24.4,6.2 24.4,9.7 v25.2,10.5
RX_IN
  Top 0.127: C18.P$2 50.3,12.5 50.3,11.2 | C20.P$2 50.3,9.5 50.3,11.2 | 50.3,11.2 51.2,11.2 51.6,11.6
  Top 1: L20.P$1 51.6,11.6 C10.P$2
SCK  (via drill 0.25)
  Top 0.152: U12.12 38.42,7.18 38.1,7.5 38.1,16.69 v38.41,17 | U13.11 36.18,17.43 36.18,18.43 37.55,19.8 v38.6,19.8 38.62,19.78 U11.12
  Layer2 0.152: v38.41,17 38.41,19.61 v38.6,19.8
SDN1  (via drill 0.25)
  Top 0.152: U13.14 33.7,17.07 v33.7,17.5 | U11.1 43.71,17.91 v43.2,17.4
  Bottom 0.152: v43.2,17.4 43.1,17.5 v33.7,17.5
SDN2  (via drill 0.25)
  Top 0.152: U13.25 26.82,11.6 25.6,11.6 24.4,10.4 24.4,4.5 v25.07,3.83 | U12.1 43.66,3.96 v43.6,3.9
  Layer2 0.152: v31.2,1.7 32.1,1.7 33.7,3.3 v37.6,3.3
  Bottom 0.152: v37.6,3.3 43,3.3 v43.6,3.9 | v25.07,3.83 27.23,3.83 27.23,3.82 29.08,3.82 v31.2,1.7
SW
  Top 0.406: L12.P$1 19.7,12.95 19.3,13.35
  Top 0.61: 19.3,13.35 U1.5
  Top 1.016: C2.P$2 21.5,12.9 L12.P$1
SWCLK  (via drill 0.25)
  Top 0.152: U13.24 26.45,12.3 v25.6,12.3 | v17,5 SWCLK.TP 17,1.88 JLINK.3
  Bottom 0.152: v17,5 17,5.2 16.5,5.7 16.5,10.9 17.2,11.6 24.9,11.6 v25.6,12.3
SWDIO  (via drill 0.25)
  Top 0.152: U13.23 27.6,14.7 26.2,14.7 25.6,14.1 v25.6,13.2 | v14,5.3 SWDIO.TP 14.18,3.82 JLINK.4
  Bottom 0.152: v25.6,13.2 24.4,12 16.8,12 14,9.2 v14,5.3
TRX_IC_CLOCK  (via drill 0.25)
  Top 0.152: U11.19 42.16,16.46 v42.1,16.4 | v32.6,10.4 v32.61,10.41 32.61,10.43 32.15,10.89 U13.3
  Bottom 0.152: v42.1,16.4 39.24,16.4 33.24,10.4 v32.6,10.4
TRX_IC_DATA
  Top 0.152: U13.15 33.2,17.28 33.2,19.1 35.43,21.33 U11.10
TX_CTRL  (via drill 0.25)
  Top 0.152: v26.9,9.9 27.1,10.1 27.44,10.1 U13.28 | v39.88,21.8 34.7,21.8 32.7,19.8 v32.7,17.8 | R11.P$2 59.1,22.1 58.4,22.8 v58.4,23.4 | U4.5 70.2,1.6 v70.4,1.4 | Q1.1 59.2,16.75 v59.2,18.5
  Top 0.254: U13.28
  Bottom 0.152: v39.88,21.8 40.51,21.17 42.8,21.17 42.93,21.3 42.93,22.55 44.18,23.8 58,23.8 v58.4,23.4 | v58.4,23.4 58.4,24.5 58.83,24.93 66.52,24.93 68.53,22.92 68.53,21.07 70.3,19.3 81.3,19.3 81.5,19.1 81.5,16.5 79.5,16.5 79.16,16.16 79.16,14.21 78.8,13.85 78.8,7.7 74.3,3.2 74.3,1.1 73.66,0.46 70.6,0.46 70.4,0.66 v70.4,1.4 | v26.9,9.9 26.9,10.4 27.6,11.1 27.6,12.7 v32.7,17.8 | v59.2,18.5 59.2,22.6 v58.4,23.4
TX_OFF  (via drill 0.25)
  Top 0.152: U13.22 28.58,14.46 27.83,15.21 25.91,15.21 v24.9,14.2 | TX_OFF.TP 14,10.1 13.9,10.2 v13.9,11.3
  Bottom 0.152: v24.9,14.2 23.1,12.4 13.9,12.4 | JP1.4 12.82,12.4 13.9,12.4 | v13.9,11.3 13.9,12.4
V_BAT
  Top 0.406: JP1.1 9.35,18.15 10.9,19.7 12.57,19.7 14,21.13 V_BAT.TP 14,23.6 14.7,24.3 Q2.3
V_IN
  Top 0.406: R6.P$1 25.4,22.3 | 25.4,22.3 18.3,22.3 18,22 18,21.5 C4.P$1 L2.P$1 | R1.P$1 25.5,22.4 25.4,22.3
  Top 0.61: Q2.2 18,21.85 18,21.5
V_LNA
  Top 0.152: Q1.3 66.6,15 67,14.6 C3.P$1 C12.P$2 L24.P$1
V_PA
  Top 0.152: C49.P$1 72.3,15.4 V_PA.TP
  Top 0.254: R5.P$2 69.4,14.4 U3.P$1
  Top 0.61: L4.P$1 72.4,18.3 72.3,18.2 C7.P$1 C49.P$1 71.4,15.5 71.05,15.85 U3.P$1
V_PA_SRC  (via drill 0.25)
  Top 0.406: v33.4,21.8 32.9,22.3 D1.C D3.C 30.2,23.6 R1.P$2
  Top 0.61: U3.P$6 U3.P$5 v65.5,16.8 65.47,16.8 65.44,16.77 C47.P$1
  Layer2 0.406: v33.4,21.8 38.66,21.8 39.37,21.09 43.09,21.09 v43.9,21.9
  Layer2 0.61: v59.7,24.4 59.6,24.5 43.8,24.5 43.8,22 v43.9,21.9
  Bottom 0.61: v65.5,16.8 65.5,16.9 68,19.4 68,22.7 66.3,24.4 v59.7,24.4 | C50.P$3 44.1,16.43 43.91,16.62 43.91,19.94 44.59,20.62 44.59,21.21 v43.9,21.9
(copper drawn outside any net)
  shapes: Top area x2

### Text on the board
Top: MAIANA™
tPlace: Rev 7.0.0
tNames: ©2015-2020 / P. Antypas | VDD | GND
bNames: JLCJLCJLCJLC